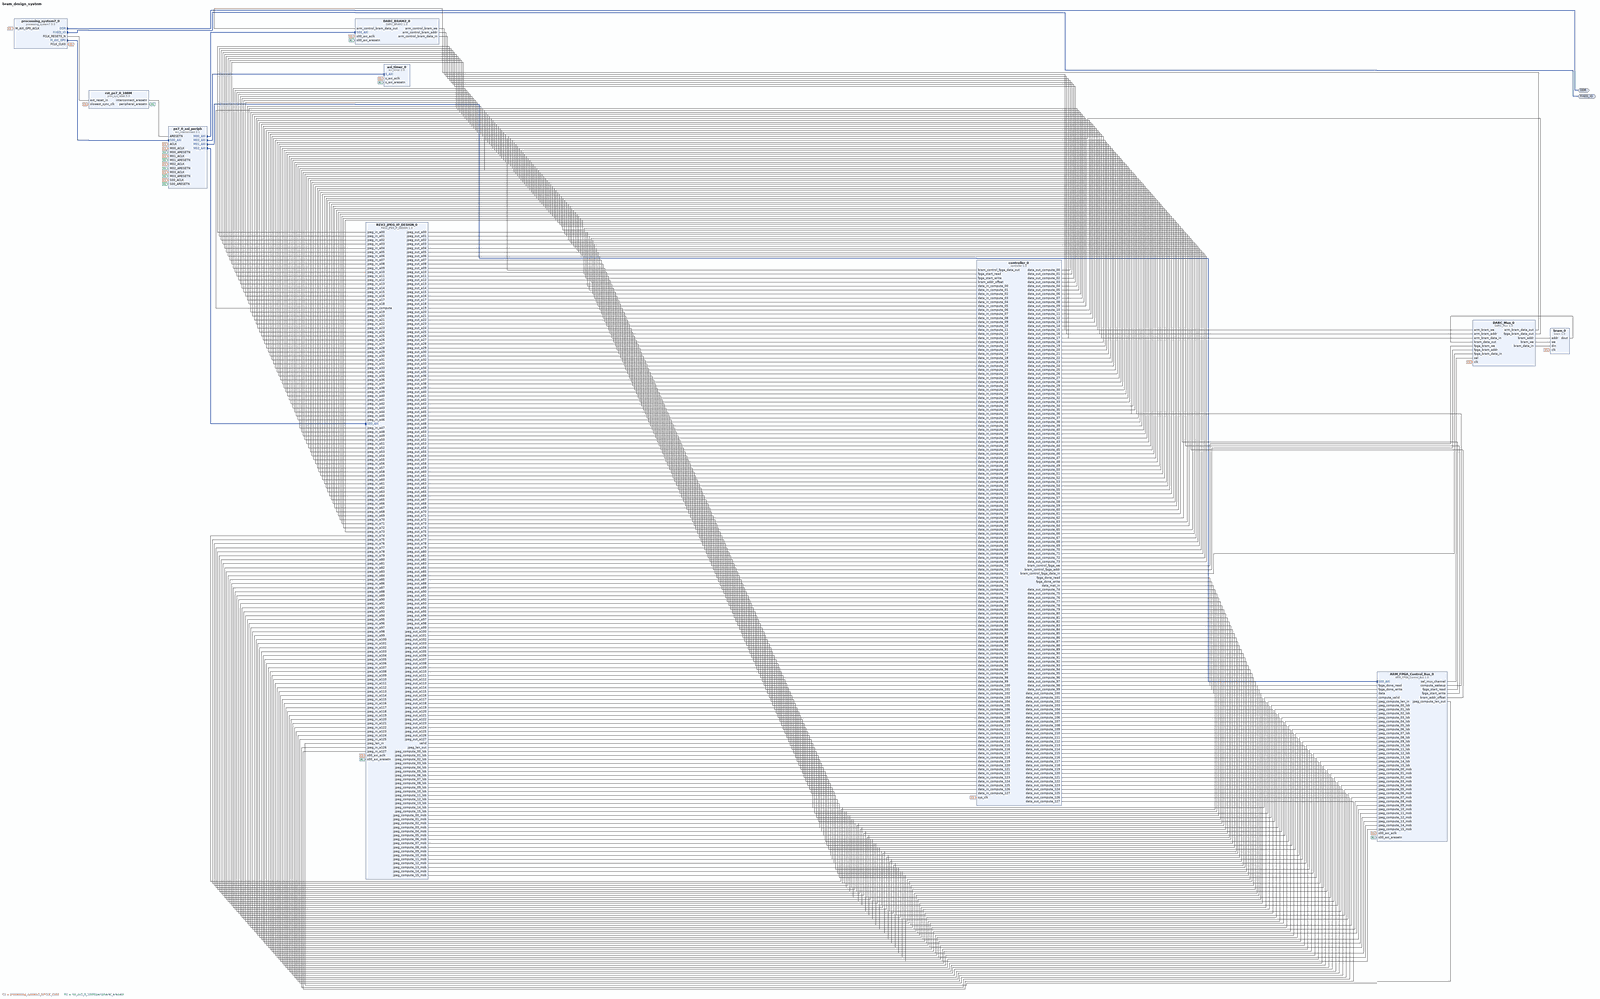
[diagram p0: block diagram of the top level, whole]
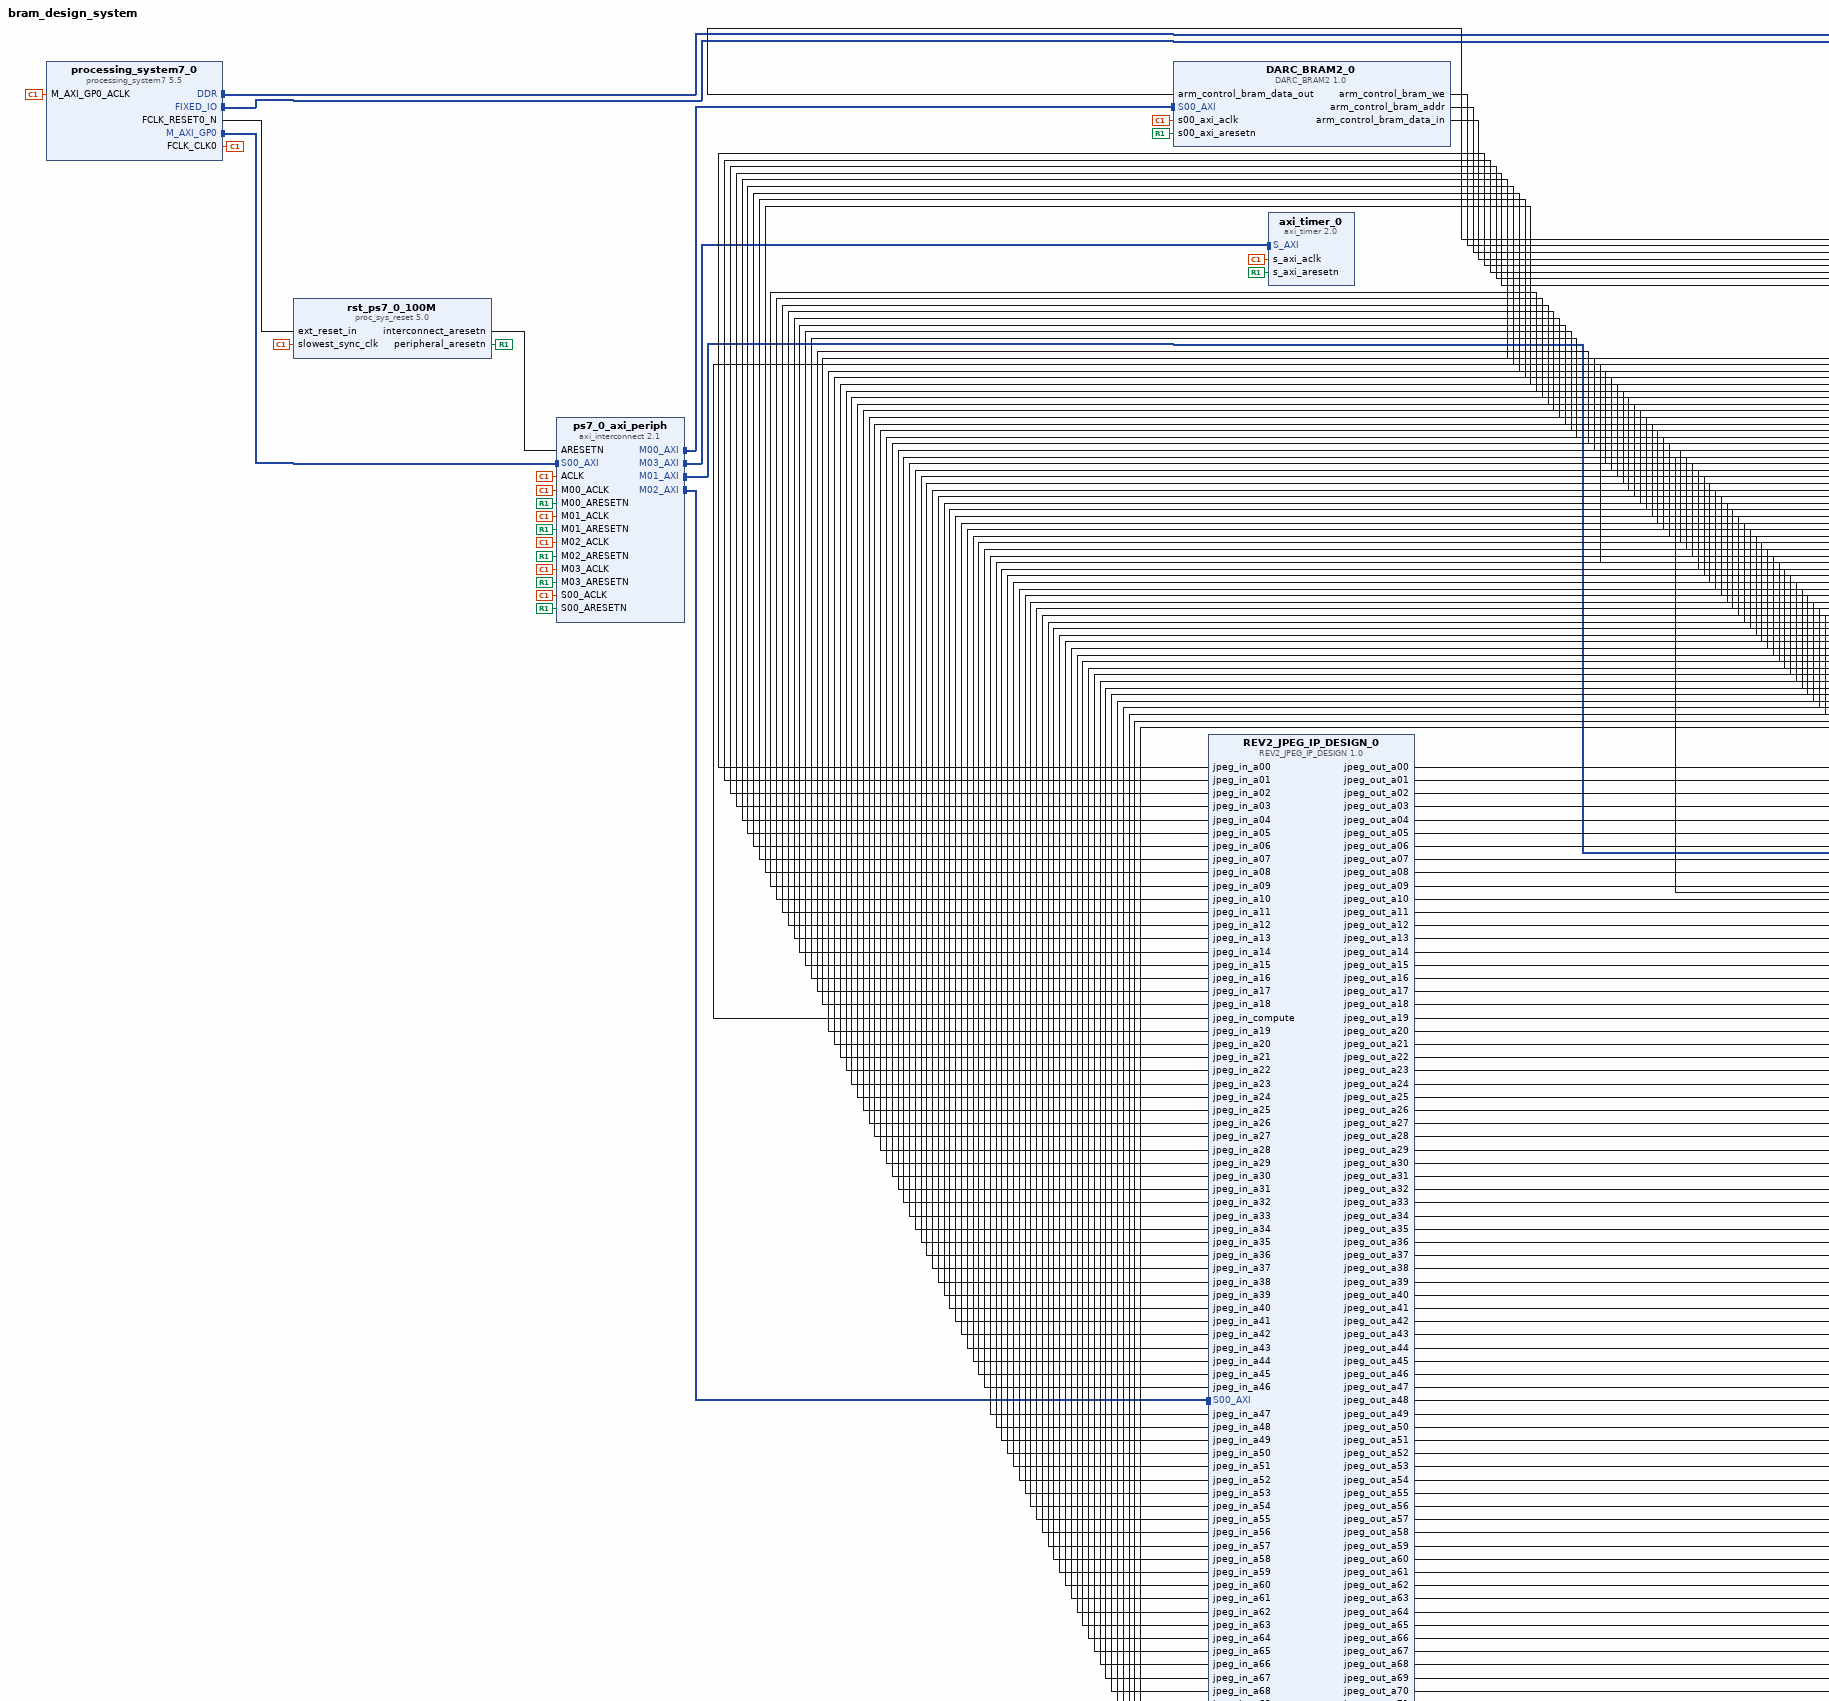
[diagram p1: block diagram of the top level, upper left part]
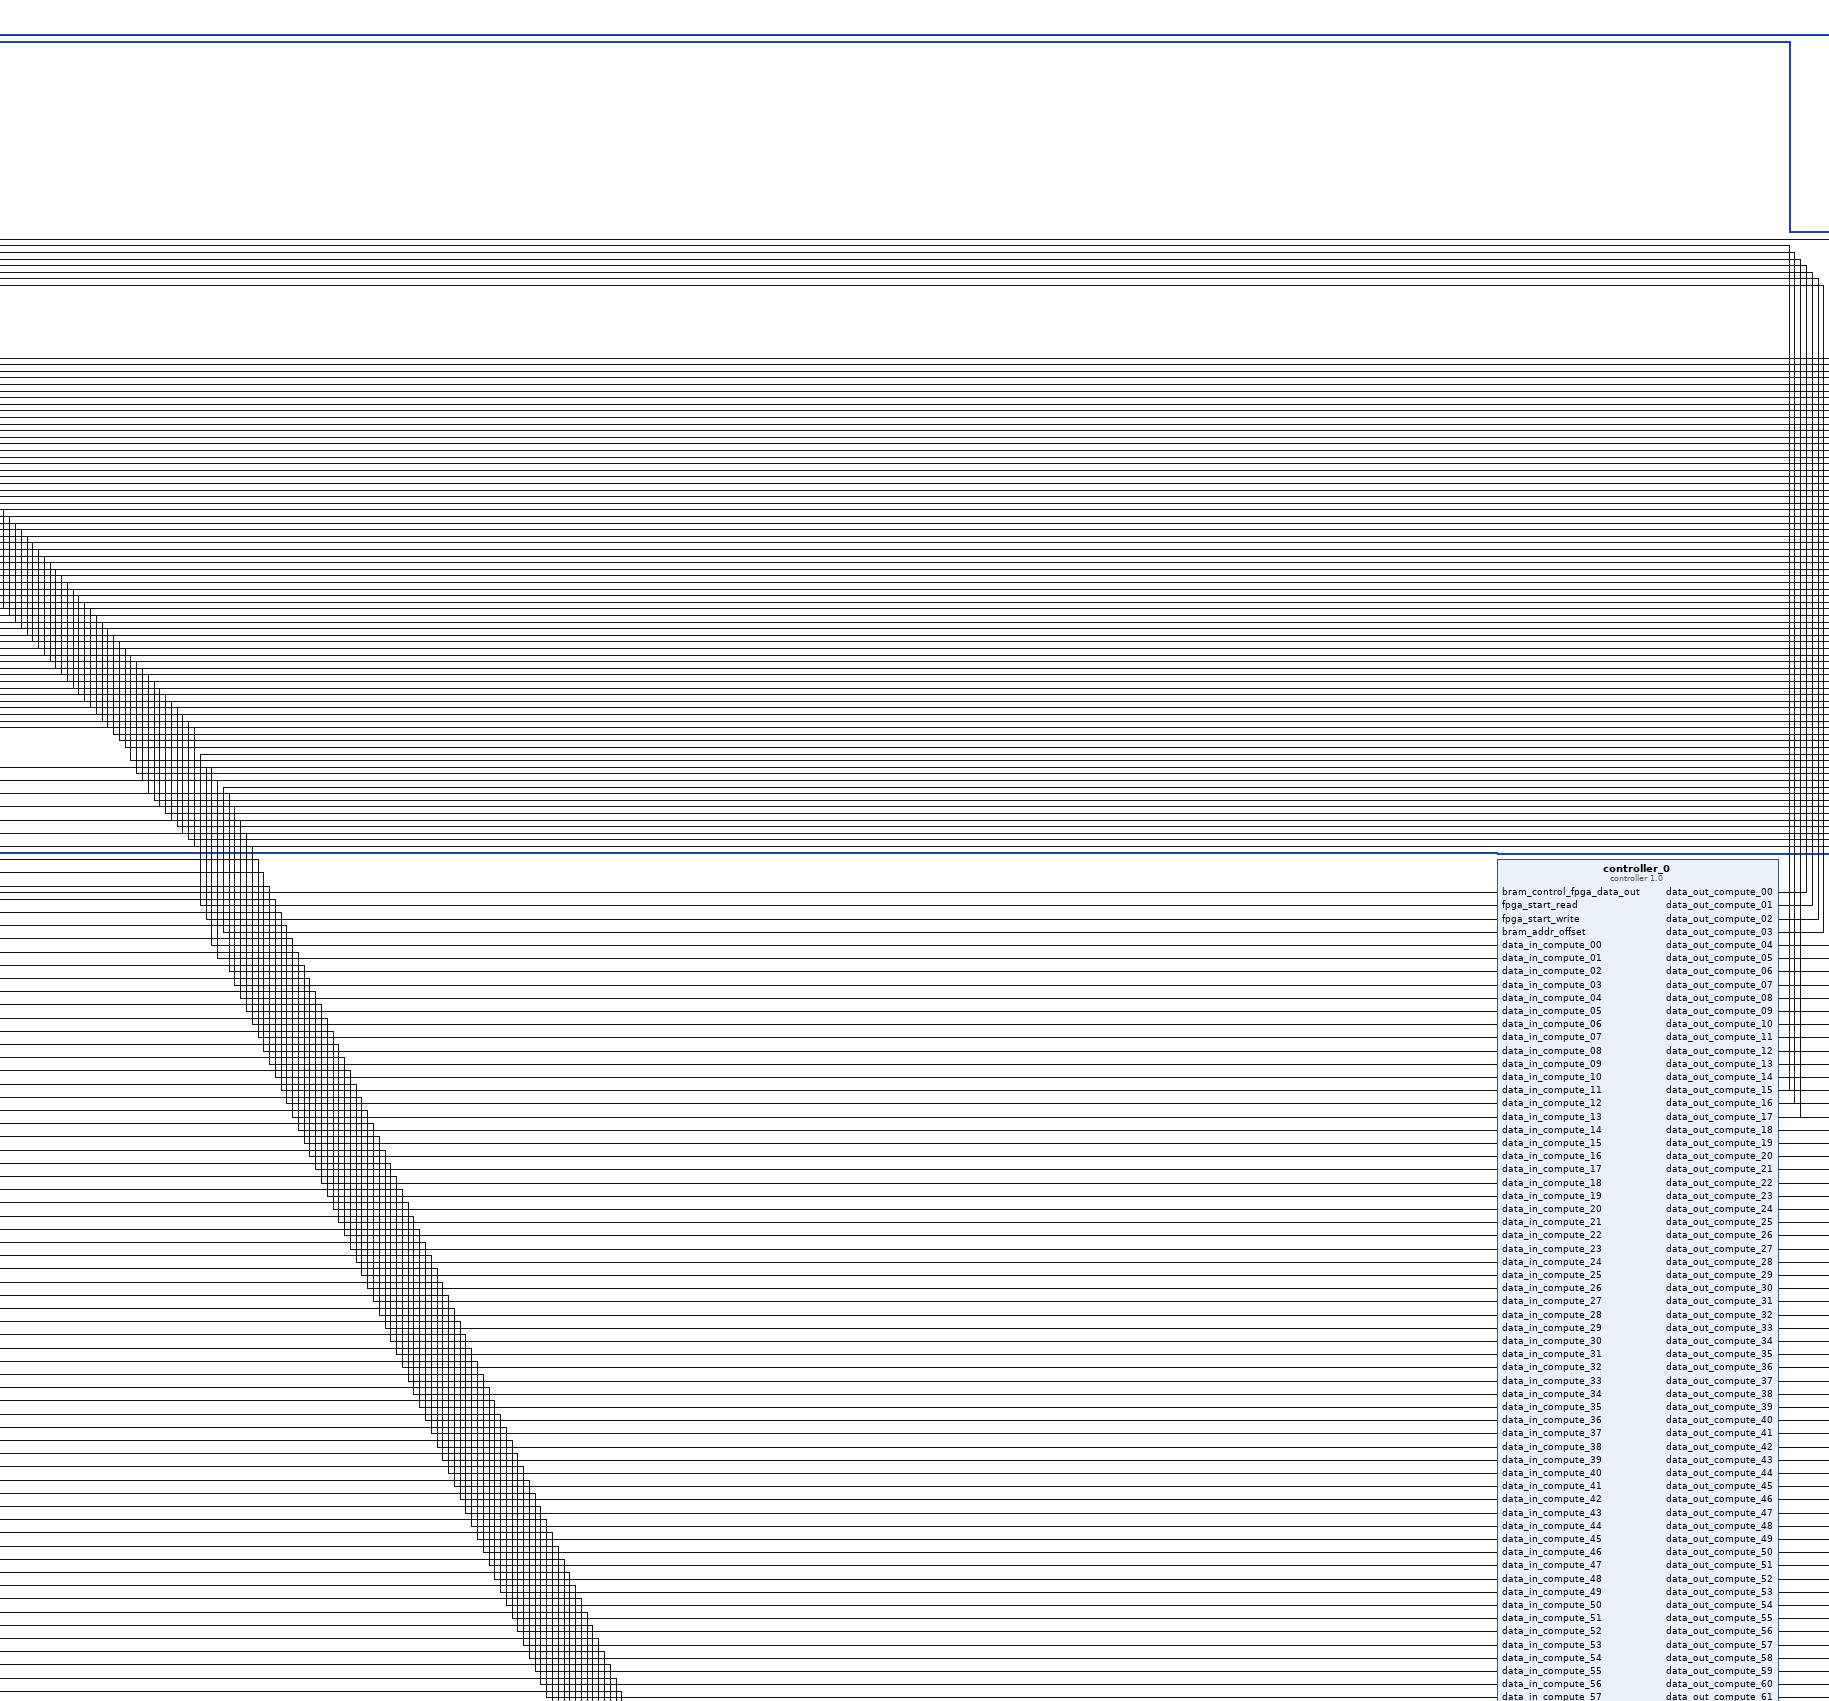
[diagram p2: block diagram of the top level, upper centre part]
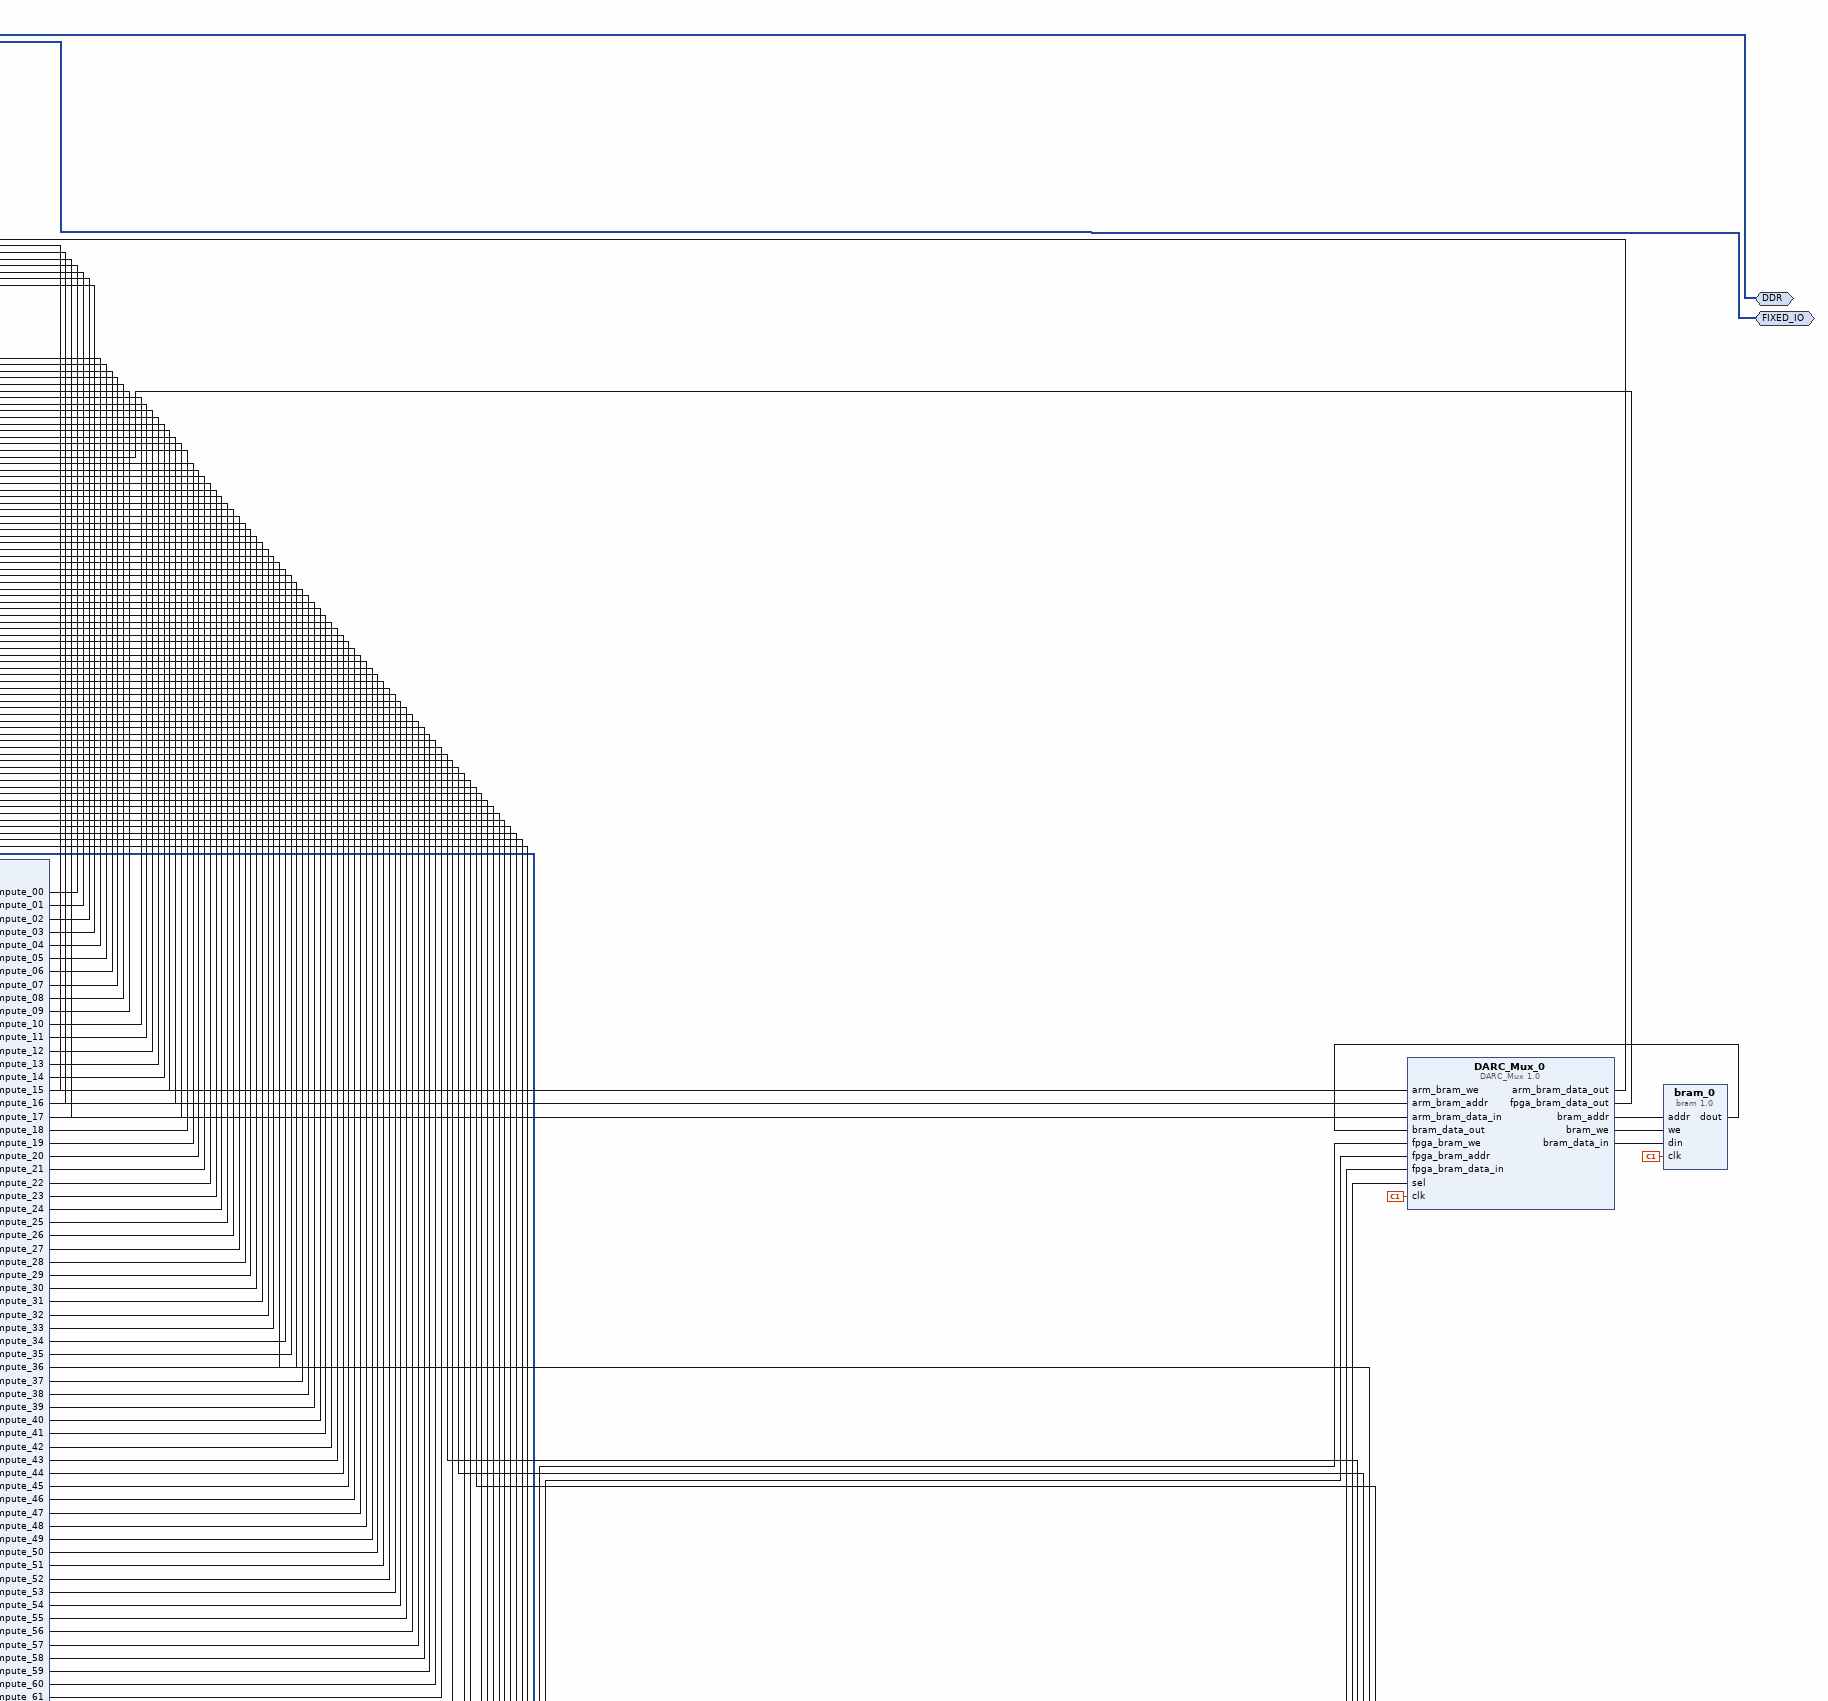
[diagram p3: block diagram of the top level, upper right part]
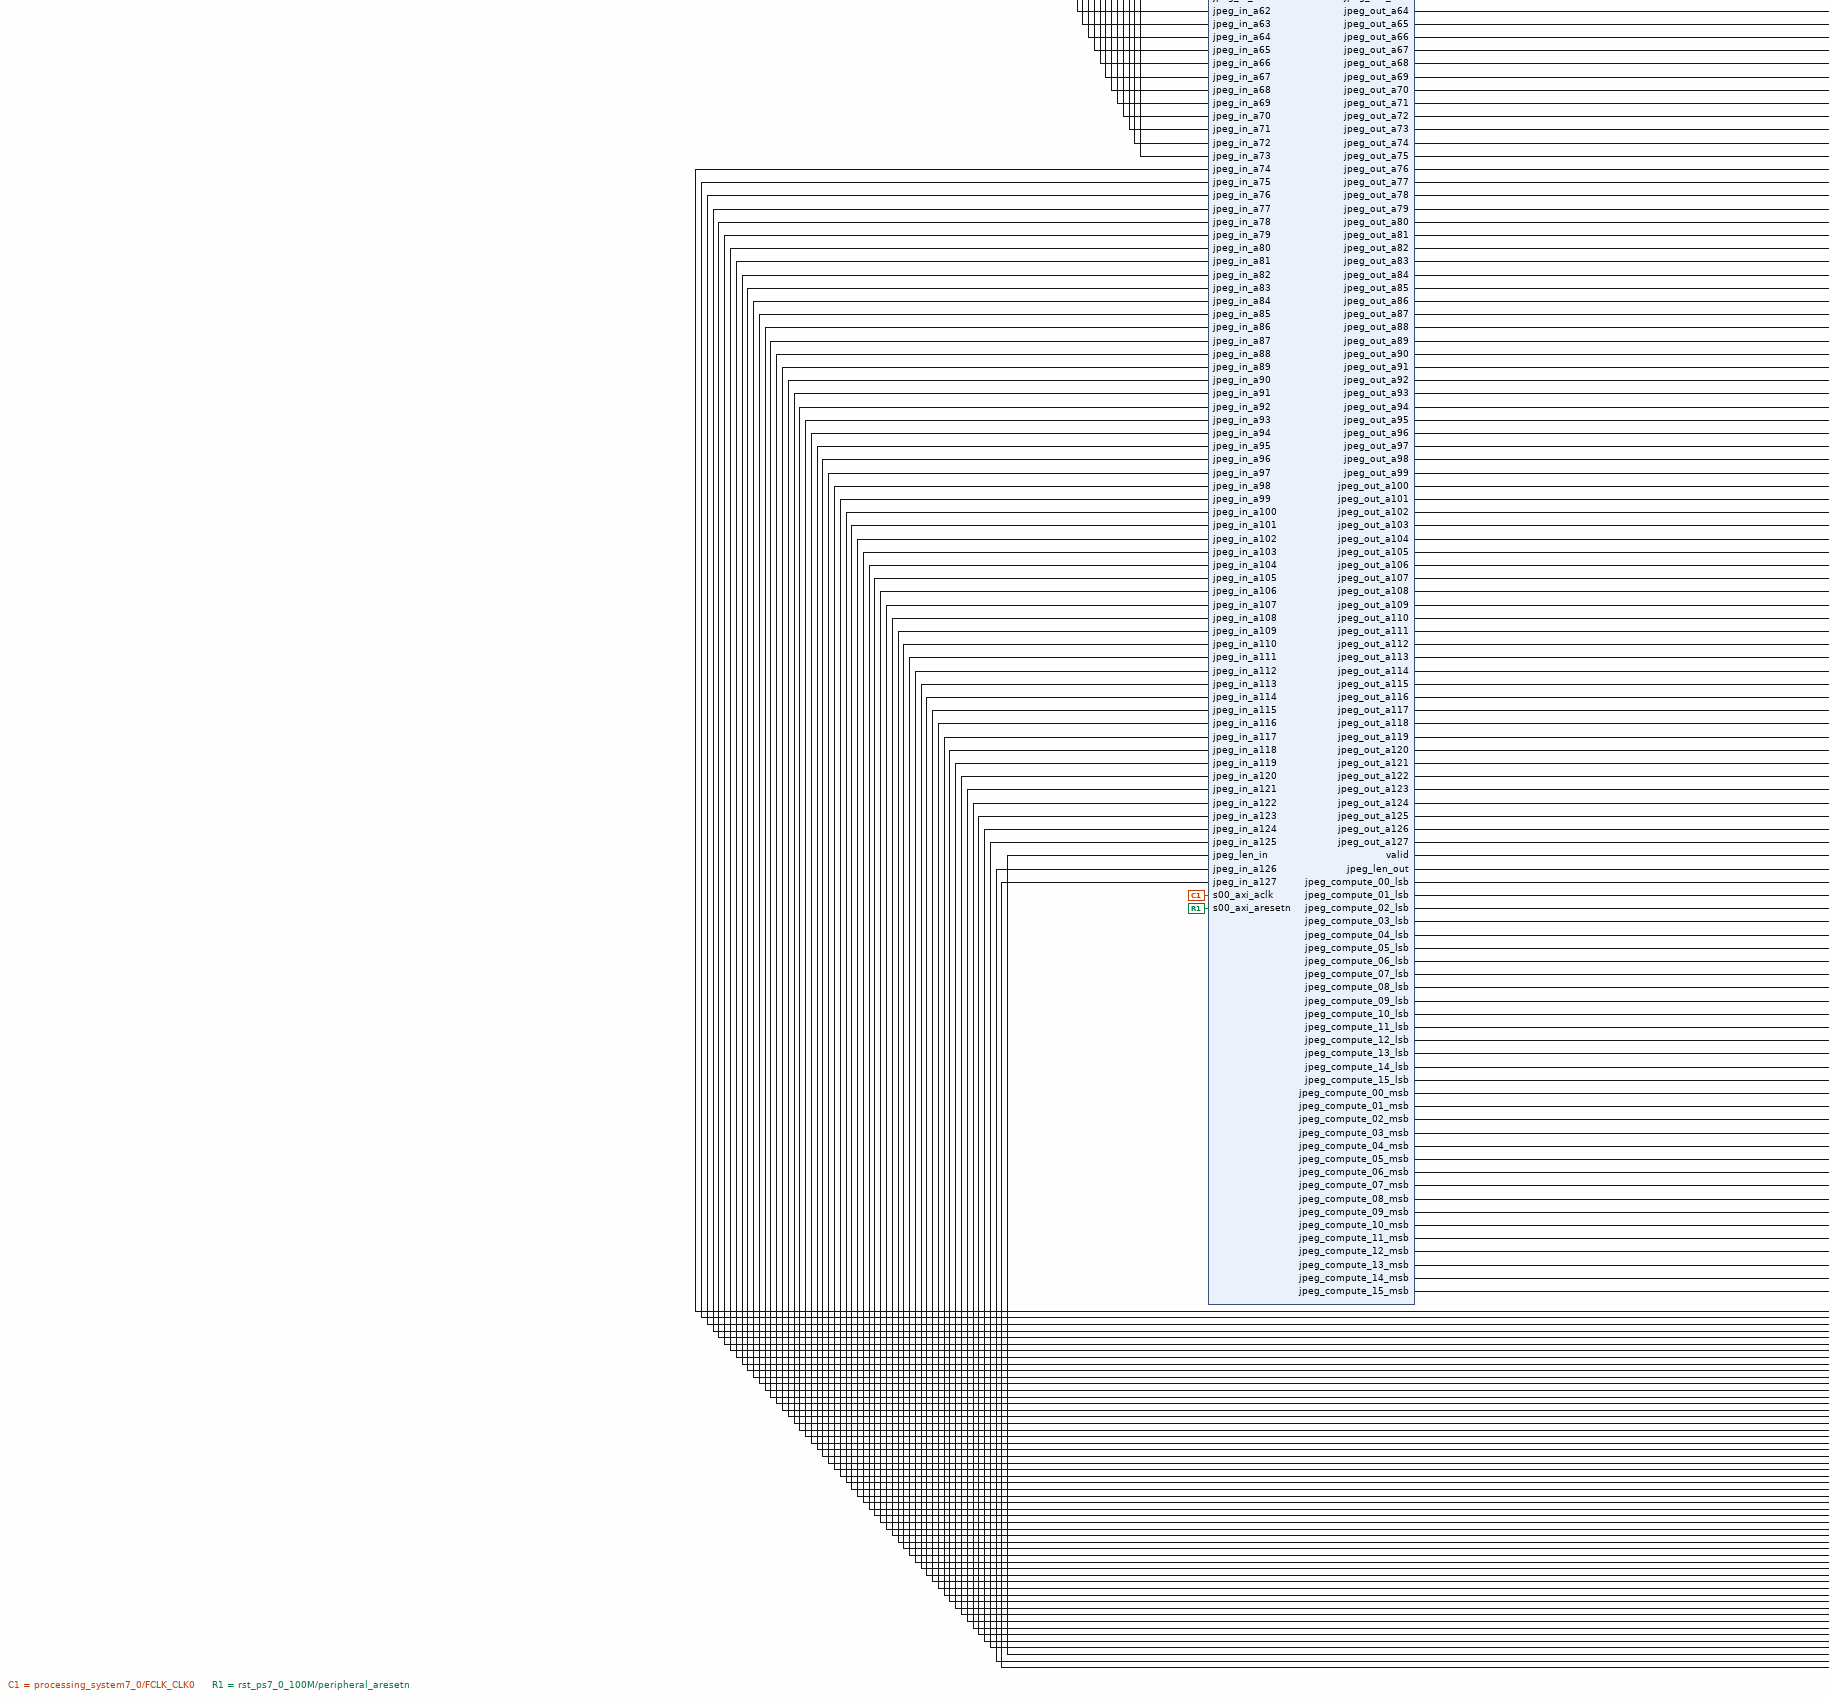
[diagram p4: block diagram of the top level, lower left part]
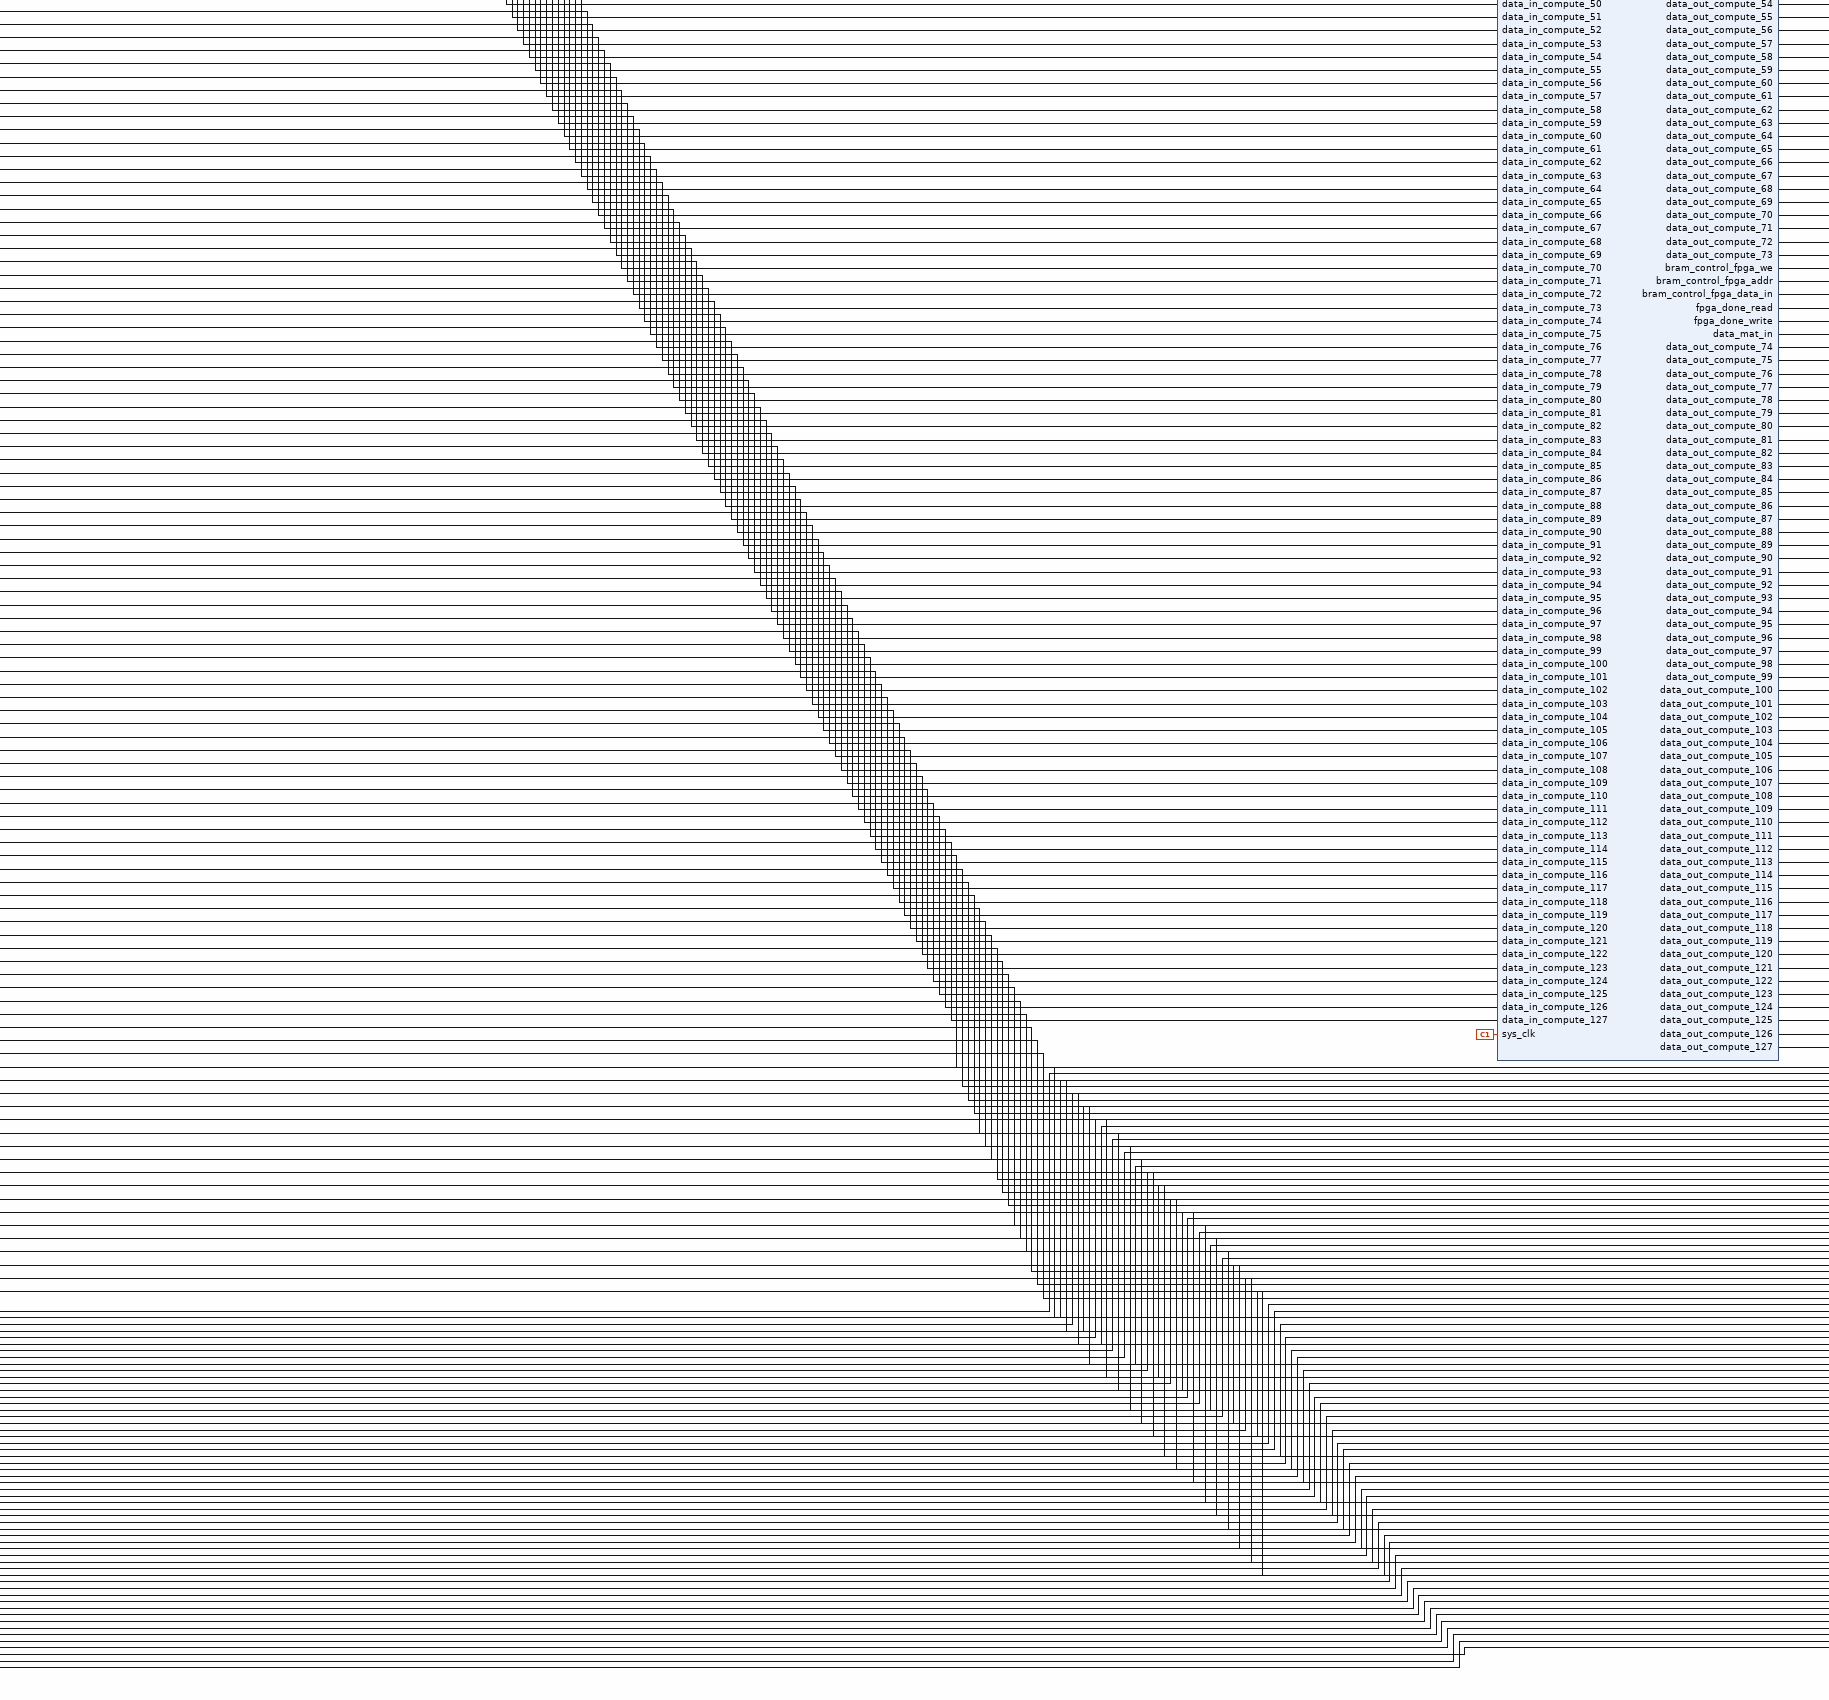
[diagram p5: block diagram of the top level, lower centre part]
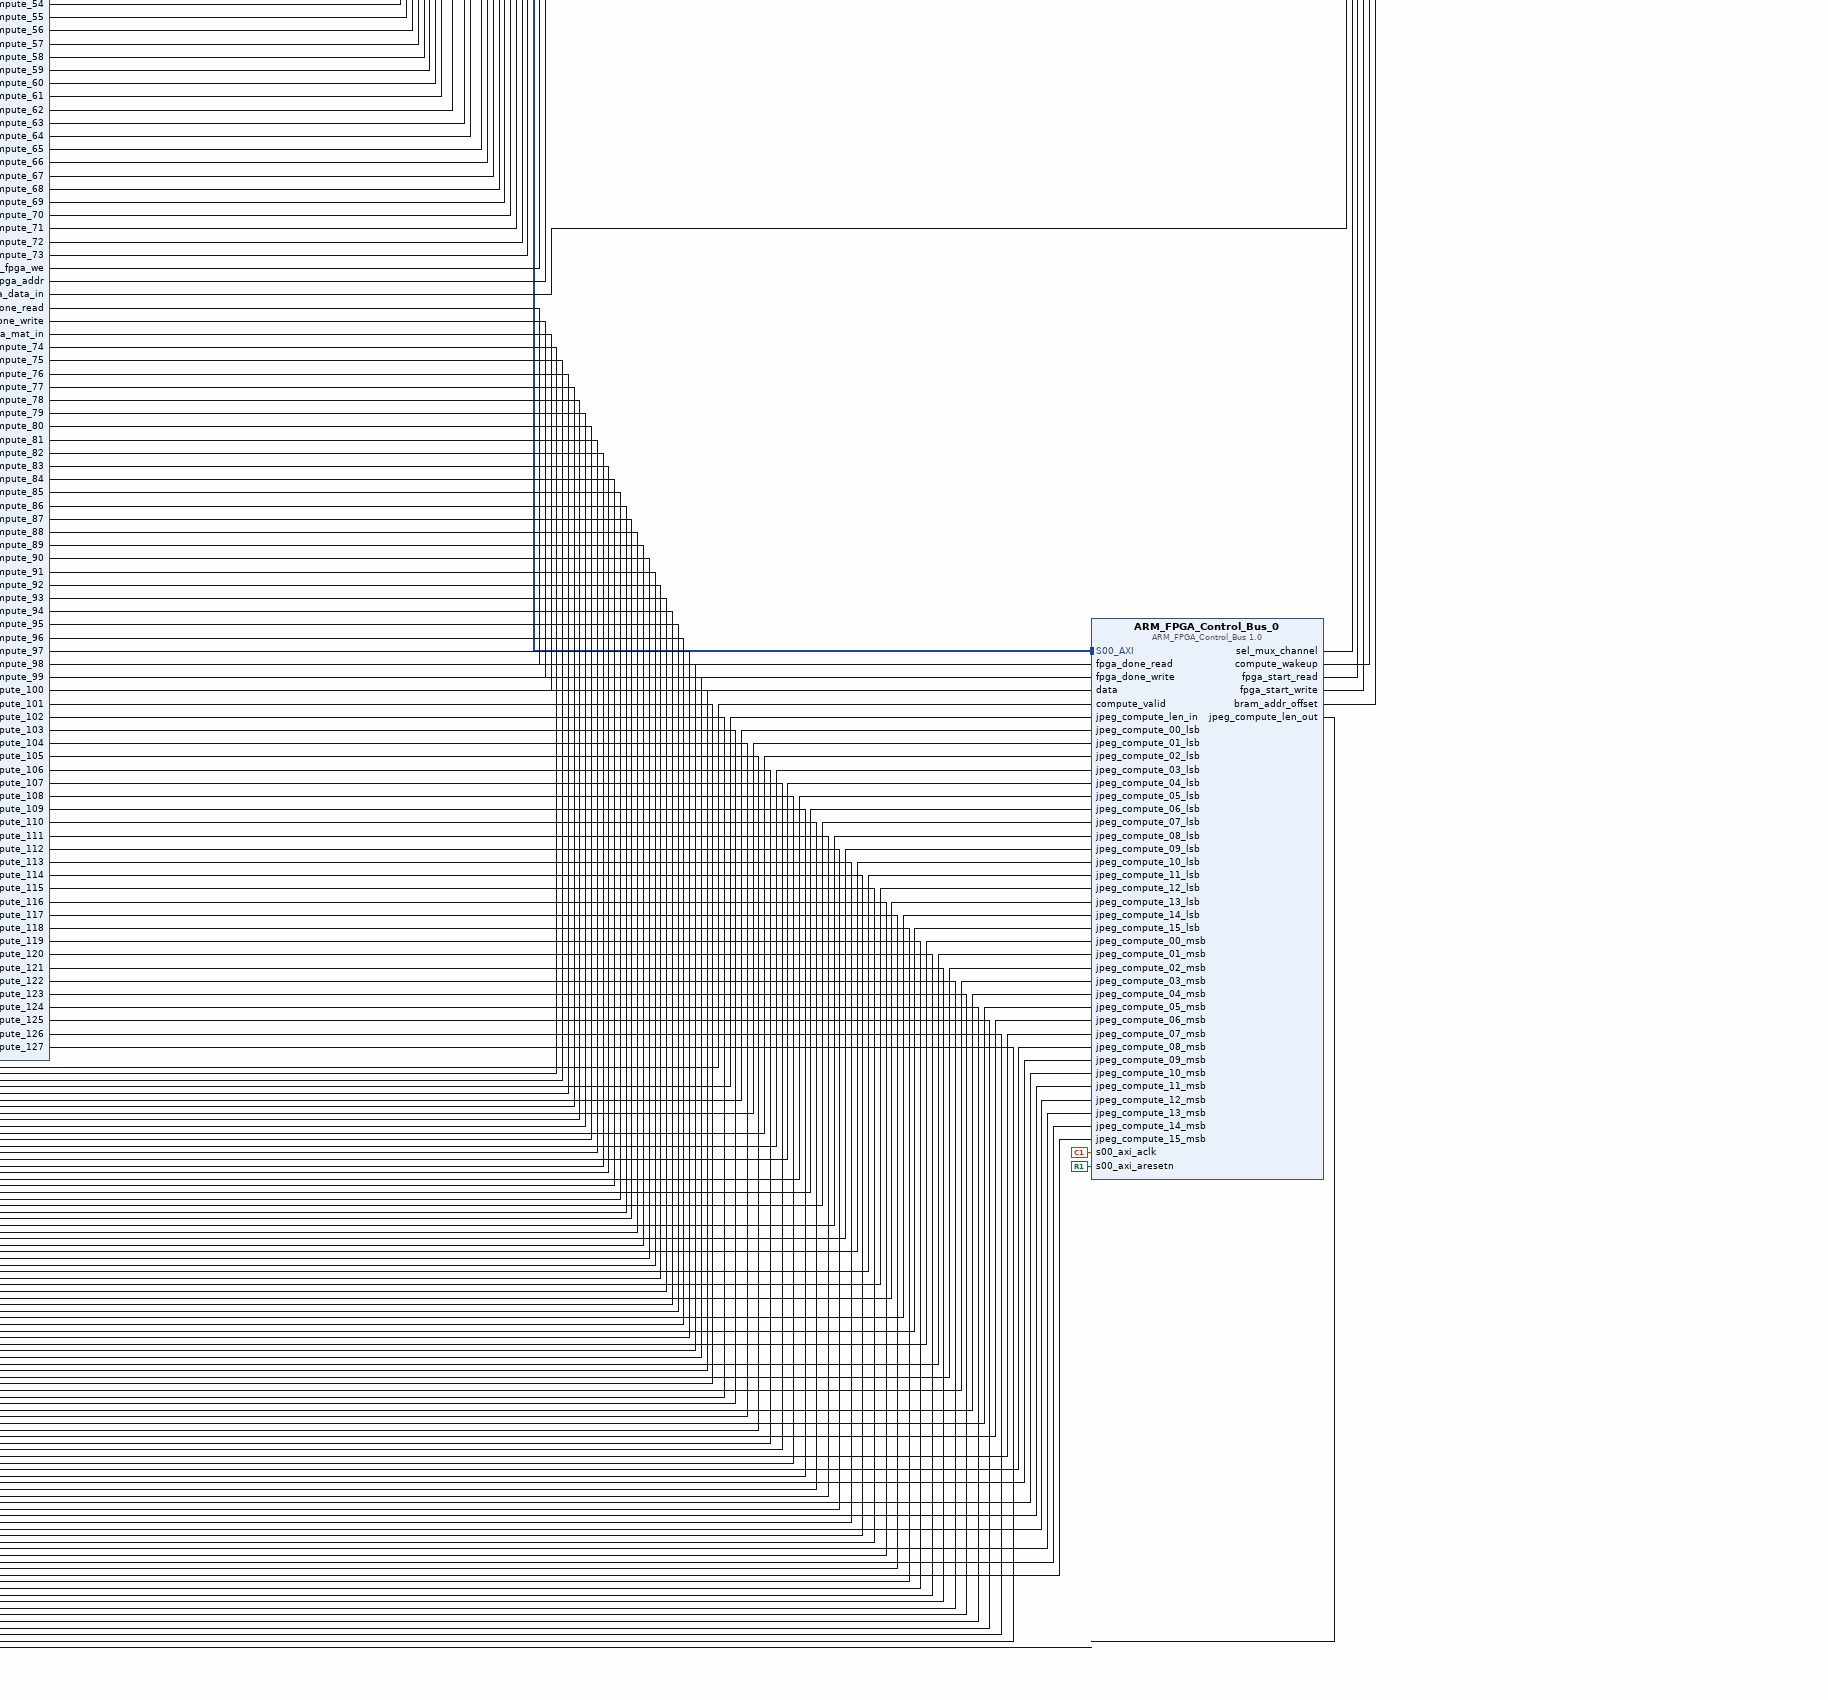
[diagram p6: block diagram of the top level, lower right part]
# Vivado block design bram_design_system, xc7z020clg484-1, Vivado 2016.3
create_bd_design bram_design_system

create_bd_intf_port -mode Master -vlnv xilinx.com:interface:ddrx_rtl:1.0 DDR
create_bd_intf_port -mode Master -vlnv xilinx.com:display_processing_system7:fixedio_rtl:1.0 FIXED_IO

create_bd_cell -type ip -vlnv xilinx.com:ip:processing_system7:5.5 processing_system7_0
set_property -dict {CONFIG.PCW_FPGA0_PERIPHERAL_FREQMHZ 50 CONFIG.preset ZedBoard} [get_bd_cells processing_system7_0]
create_bd_cell -type ip -vlnv xilinx.com:ip:axi_interconnect:2.1 ps7_0_axi_periph
set_property -dict {CONFIG.NUM_MI 4} [get_bd_cells ps7_0_axi_periph]
create_bd_cell -type ip -vlnv xilinx.com:ip:proc_sys_reset:5.0 rst_ps7_0_100M
create_bd_cell -type ip -vlnv xilinx.com:user:DARC_BRAM2:1.0 DARC_BRAM2_0
create_bd_cell -type ip -vlnv xilinx.com:user:DARC_Mux:1.0 DARC_Mux_0
create_bd_cell -type ip -vlnv xilinx.com:user:bram:1.0 bram_0
create_bd_cell -type ip -vlnv xilinx.com:user:ARM_FPGA_Control_Bus:1.0 ARM_FPGA_Control_Bus_0
create_bd_cell -type ip -vlnv xilinx.com:user:REV2_JPEG_IP_DESIGN:1.0 REV2_JPEG_IP_DESIGN_0
create_bd_cell -type ip -vlnv xilinx.com:user:controller:1.0 controller_0
create_bd_cell -type ip -vlnv xilinx.com:ip:axi_timer:2.0 axi_timer_0

# ---- connections ----

connect_bd_intf_net [get_bd_intf_pins processing_system7_0/M_AXI_GP0] [get_bd_intf_pins ps7_0_axi_periph/S00_AXI]
connect_bd_intf_net [get_bd_intf_pins ps7_0_axi_periph/M00_AXI] [get_bd_intf_pins DARC_BRAM2_0/S00_AXI]
connect_bd_intf_net [get_bd_intf_pins ps7_0_axi_periph/M01_AXI] [get_bd_intf_pins ARM_FPGA_Control_Bus_0/S00_AXI]
connect_bd_intf_net [get_bd_intf_pins ps7_0_axi_periph/M02_AXI] [get_bd_intf_pins REV2_JPEG_IP_DESIGN_0/S00_AXI]
connect_bd_intf_net [get_bd_intf_pins ps7_0_axi_periph/M03_AXI] [get_bd_intf_pins axi_timer_0/S_AXI]
connect_bd_intf_net [get_bd_intf_ports DDR] [get_bd_intf_pins processing_system7_0/DDR]
connect_bd_intf_net [get_bd_intf_ports FIXED_IO] [get_bd_intf_pins processing_system7_0/FIXED_IO]
connect_bd_net [get_bd_pins processing_system7_0/FCLK_CLK0] \
  [get_bd_pins processing_system7_0/M_AXI_GP0_ACLK] [get_bd_pins rst_ps7_0_100M/slowest_sync_clk] \
  [get_bd_pins DARC_BRAM2_0/s00_axi_aclk] [get_bd_pins DARC_Mux_0/clk] [get_bd_pins bram_0/clk] \
  [get_bd_pins ps7_0_axi_periph/S00_ACLK] [get_bd_pins ps7_0_axi_periph/ACLK] [get_bd_pins ps7_0_axi_periph/M00_ACLK] \
  [get_bd_pins ps7_0_axi_periph/M01_ACLK] [get_bd_pins ps7_0_axi_periph/M02_ACLK] \
  [get_bd_pins ARM_FPGA_Control_Bus_0/s00_axi_aclk] [get_bd_pins REV2_JPEG_IP_DESIGN_0/s00_axi_aclk] \
  [get_bd_pins controller_0/sys_clk] [get_bd_pins axi_timer_0/s_axi_aclk] [get_bd_pins ps7_0_axi_periph/M03_ACLK]
connect_bd_net [get_bd_pins processing_system7_0/FCLK_RESET0_N] [get_bd_pins rst_ps7_0_100M/ext_reset_in]
connect_bd_net [get_bd_pins rst_ps7_0_100M/peripheral_aresetn] \
  [get_bd_pins DARC_BRAM2_0/s00_axi_aresetn] [get_bd_pins ps7_0_axi_periph/S00_ARESETN] \
  [get_bd_pins ps7_0_axi_periph/M00_ARESETN] [get_bd_pins ps7_0_axi_periph/M01_ARESETN] \
  [get_bd_pins ps7_0_axi_periph/M02_ARESETN] [get_bd_pins ARM_FPGA_Control_Bus_0/s00_axi_aresetn] \
  [get_bd_pins REV2_JPEG_IP_DESIGN_0/s00_axi_aresetn] [get_bd_pins axi_timer_0/s_axi_aresetn] \
  [get_bd_pins ps7_0_axi_periph/M03_ARESETN]
connect_bd_net [get_bd_pins rst_ps7_0_100M/interconnect_aresetn] [get_bd_pins ps7_0_axi_periph/ARESETN]
connect_bd_net [get_bd_pins DARC_Mux_0/bram_addr] [get_bd_pins bram_0/addr]
connect_bd_net [get_bd_pins DARC_Mux_0/bram_we] [get_bd_pins bram_0/we]
connect_bd_net [get_bd_pins DARC_Mux_0/bram_data_in] [get_bd_pins bram_0/din]
connect_bd_net [get_bd_pins bram_0/dout] [get_bd_pins DARC_Mux_0/bram_data_out]
connect_bd_net [get_bd_pins DARC_Mux_0/arm_bram_data_out] [get_bd_pins DARC_BRAM2_0/arm_control_bram_data_out]
connect_bd_net [get_bd_pins DARC_BRAM2_0/arm_control_bram_we] [get_bd_pins DARC_Mux_0/arm_bram_we]
connect_bd_net [get_bd_pins DARC_BRAM2_0/arm_control_bram_addr] [get_bd_pins DARC_Mux_0/arm_bram_addr]
connect_bd_net [get_bd_pins DARC_BRAM2_0/arm_control_bram_data_in] [get_bd_pins DARC_Mux_0/arm_bram_data_in]
connect_bd_net [get_bd_pins ARM_FPGA_Control_Bus_0/sel_mux_channel] [get_bd_pins DARC_Mux_0/sel]
connect_bd_net [get_bd_pins controller_0/bram_control_fpga_we] [get_bd_pins DARC_Mux_0/fpga_bram_we]
connect_bd_net [get_bd_pins controller_0/bram_control_fpga_addr] [get_bd_pins DARC_Mux_0/fpga_bram_addr]
connect_bd_net [get_bd_pins controller_0/bram_control_fpga_data_in] [get_bd_pins DARC_Mux_0/fpga_bram_data_in]
connect_bd_net [get_bd_pins ARM_FPGA_Control_Bus_0/fpga_start_read] [get_bd_pins controller_0/fpga_start_read]
connect_bd_net [get_bd_pins ARM_FPGA_Control_Bus_0/fpga_start_write] [get_bd_pins controller_0/fpga_start_write]
connect_bd_net [get_bd_pins controller_0/fpga_done_read] [get_bd_pins ARM_FPGA_Control_Bus_0/fpga_done_read]
connect_bd_net [get_bd_pins controller_0/fpga_done_write] [get_bd_pins ARM_FPGA_Control_Bus_0/fpga_done_write]
connect_bd_net [get_bd_pins DARC_Mux_0/fpga_bram_data_out] [get_bd_pins controller_0/bram_control_fpga_data_out]
connect_bd_net [get_bd_pins controller_0/data_mat_in] [get_bd_pins ARM_FPGA_Control_Bus_0/data]
connect_bd_net [get_bd_pins REV2_JPEG_IP_DESIGN_0/valid] [get_bd_pins ARM_FPGA_Control_Bus_0/compute_valid]
connect_bd_net [get_bd_pins ARM_FPGA_Control_Bus_0/compute_wakeup] [get_bd_pins REV2_JPEG_IP_DESIGN_0/jpeg_in_compute]
connect_bd_net [get_bd_pins controller_0/data_out_compute_00] [get_bd_pins REV2_JPEG_IP_DESIGN_0/jpeg_in_a00]
connect_bd_net [get_bd_pins controller_0/data_out_compute_01] [get_bd_pins REV2_JPEG_IP_DESIGN_0/jpeg_in_a01]
connect_bd_net [get_bd_pins controller_0/data_out_compute_02] [get_bd_pins REV2_JPEG_IP_DESIGN_0/jpeg_in_a02]
connect_bd_net [get_bd_pins controller_0/data_out_compute_03] [get_bd_pins REV2_JPEG_IP_DESIGN_0/jpeg_in_a03]
connect_bd_net [get_bd_pins controller_0/data_out_compute_04] [get_bd_pins REV2_JPEG_IP_DESIGN_0/jpeg_in_a04]
connect_bd_net [get_bd_pins controller_0/data_out_compute_05] [get_bd_pins REV2_JPEG_IP_DESIGN_0/jpeg_in_a05]
connect_bd_net [get_bd_pins controller_0/data_out_compute_06] [get_bd_pins REV2_JPEG_IP_DESIGN_0/jpeg_in_a06]
connect_bd_net [get_bd_pins controller_0/data_out_compute_07] [get_bd_pins REV2_JPEG_IP_DESIGN_0/jpeg_in_a07]
connect_bd_net [get_bd_pins controller_0/data_out_compute_08] [get_bd_pins REV2_JPEG_IP_DESIGN_0/jpeg_in_a08]
connect_bd_net [get_bd_pins controller_0/data_out_compute_09] [get_bd_pins REV2_JPEG_IP_DESIGN_0/jpeg_in_a09]
connect_bd_net [get_bd_pins controller_0/data_out_compute_10] [get_bd_pins REV2_JPEG_IP_DESIGN_0/jpeg_in_a10]
connect_bd_net [get_bd_pins controller_0/data_out_compute_11] [get_bd_pins REV2_JPEG_IP_DESIGN_0/jpeg_in_a11]
connect_bd_net [get_bd_pins controller_0/data_out_compute_12] [get_bd_pins REV2_JPEG_IP_DESIGN_0/jpeg_in_a12]
connect_bd_net [get_bd_pins controller_0/data_out_compute_13] [get_bd_pins REV2_JPEG_IP_DESIGN_0/jpeg_in_a13]
connect_bd_net [get_bd_pins controller_0/data_out_compute_14] [get_bd_pins REV2_JPEG_IP_DESIGN_0/jpeg_in_a14]
connect_bd_net [get_bd_pins controller_0/data_out_compute_15] [get_bd_pins REV2_JPEG_IP_DESIGN_0/jpeg_in_a15]
connect_bd_net [get_bd_pins controller_0/data_out_compute_16] [get_bd_pins REV2_JPEG_IP_DESIGN_0/jpeg_in_a16]
connect_bd_net [get_bd_pins controller_0/data_out_compute_17] [get_bd_pins REV2_JPEG_IP_DESIGN_0/jpeg_in_a17]
connect_bd_net [get_bd_pins controller_0/data_out_compute_18] [get_bd_pins REV2_JPEG_IP_DESIGN_0/jpeg_in_a18]
connect_bd_net [get_bd_pins controller_0/data_out_compute_19] [get_bd_pins REV2_JPEG_IP_DESIGN_0/jpeg_in_a19]
connect_bd_net [get_bd_pins controller_0/data_out_compute_20] [get_bd_pins REV2_JPEG_IP_DESIGN_0/jpeg_in_a20]
connect_bd_net [get_bd_pins controller_0/data_out_compute_21] [get_bd_pins REV2_JPEG_IP_DESIGN_0/jpeg_in_a21]
connect_bd_net [get_bd_pins controller_0/data_out_compute_22] [get_bd_pins REV2_JPEG_IP_DESIGN_0/jpeg_in_a22]
connect_bd_net [get_bd_pins controller_0/data_out_compute_23] [get_bd_pins REV2_JPEG_IP_DESIGN_0/jpeg_in_a23]
connect_bd_net [get_bd_pins controller_0/data_out_compute_24] [get_bd_pins REV2_JPEG_IP_DESIGN_0/jpeg_in_a24]
connect_bd_net [get_bd_pins controller_0/data_out_compute_25] [get_bd_pins REV2_JPEG_IP_DESIGN_0/jpeg_in_a25]
connect_bd_net [get_bd_pins controller_0/data_out_compute_26] [get_bd_pins REV2_JPEG_IP_DESIGN_0/jpeg_in_a26]
connect_bd_net [get_bd_pins controller_0/data_out_compute_27] [get_bd_pins REV2_JPEG_IP_DESIGN_0/jpeg_in_a27]
connect_bd_net [get_bd_pins controller_0/data_out_compute_28] [get_bd_pins REV2_JPEG_IP_DESIGN_0/jpeg_in_a28]
connect_bd_net [get_bd_pins controller_0/data_out_compute_29] [get_bd_pins REV2_JPEG_IP_DESIGN_0/jpeg_in_a29]
connect_bd_net [get_bd_pins controller_0/data_out_compute_30] [get_bd_pins REV2_JPEG_IP_DESIGN_0/jpeg_in_a30]
connect_bd_net [get_bd_pins controller_0/data_out_compute_31] [get_bd_pins REV2_JPEG_IP_DESIGN_0/jpeg_in_a31]
connect_bd_net [get_bd_pins controller_0/data_out_compute_32] [get_bd_pins REV2_JPEG_IP_DESIGN_0/jpeg_in_a32]
connect_bd_net [get_bd_pins controller_0/data_out_compute_33] [get_bd_pins REV2_JPEG_IP_DESIGN_0/jpeg_in_a33]
connect_bd_net [get_bd_pins controller_0/data_out_compute_34] [get_bd_pins REV2_JPEG_IP_DESIGN_0/jpeg_in_a34]
connect_bd_net [get_bd_pins controller_0/data_out_compute_35] [get_bd_pins REV2_JPEG_IP_DESIGN_0/jpeg_in_a35]
connect_bd_net [get_bd_pins controller_0/data_out_compute_36] [get_bd_pins REV2_JPEG_IP_DESIGN_0/jpeg_in_a36]
connect_bd_net [get_bd_pins controller_0/data_out_compute_37] [get_bd_pins REV2_JPEG_IP_DESIGN_0/jpeg_in_a37]
connect_bd_net [get_bd_pins controller_0/data_out_compute_38] [get_bd_pins REV2_JPEG_IP_DESIGN_0/jpeg_in_a38]
connect_bd_net [get_bd_pins controller_0/data_out_compute_39] [get_bd_pins REV2_JPEG_IP_DESIGN_0/jpeg_in_a39]
connect_bd_net [get_bd_pins controller_0/data_out_compute_40] [get_bd_pins REV2_JPEG_IP_DESIGN_0/jpeg_in_a40]
connect_bd_net [get_bd_pins controller_0/data_out_compute_41] [get_bd_pins REV2_JPEG_IP_DESIGN_0/jpeg_in_a41]
connect_bd_net [get_bd_pins controller_0/data_out_compute_42] [get_bd_pins REV2_JPEG_IP_DESIGN_0/jpeg_in_a42]
connect_bd_net [get_bd_pins controller_0/data_out_compute_43] [get_bd_pins REV2_JPEG_IP_DESIGN_0/jpeg_in_a43]
connect_bd_net [get_bd_pins controller_0/data_out_compute_44] [get_bd_pins REV2_JPEG_IP_DESIGN_0/jpeg_in_a44]
connect_bd_net [get_bd_pins controller_0/data_out_compute_45] [get_bd_pins REV2_JPEG_IP_DESIGN_0/jpeg_in_a45]
connect_bd_net [get_bd_pins controller_0/data_out_compute_46] [get_bd_pins REV2_JPEG_IP_DESIGN_0/jpeg_in_a46]
connect_bd_net [get_bd_pins controller_0/data_out_compute_47] [get_bd_pins REV2_JPEG_IP_DESIGN_0/jpeg_in_a47]
connect_bd_net [get_bd_pins controller_0/data_out_compute_48] [get_bd_pins REV2_JPEG_IP_DESIGN_0/jpeg_in_a48]
connect_bd_net [get_bd_pins controller_0/data_out_compute_49] [get_bd_pins REV2_JPEG_IP_DESIGN_0/jpeg_in_a49]
connect_bd_net [get_bd_pins controller_0/data_out_compute_50] [get_bd_pins REV2_JPEG_IP_DESIGN_0/jpeg_in_a50]
connect_bd_net [get_bd_pins controller_0/data_out_compute_51] [get_bd_pins REV2_JPEG_IP_DESIGN_0/jpeg_in_a51]
connect_bd_net [get_bd_pins controller_0/data_out_compute_52] [get_bd_pins REV2_JPEG_IP_DESIGN_0/jpeg_in_a52]
connect_bd_net [get_bd_pins controller_0/data_out_compute_53] [get_bd_pins REV2_JPEG_IP_DESIGN_0/jpeg_in_a53]
connect_bd_net [get_bd_pins controller_0/data_out_compute_54] [get_bd_pins REV2_JPEG_IP_DESIGN_0/jpeg_in_a54]
connect_bd_net [get_bd_pins controller_0/data_out_compute_55] [get_bd_pins REV2_JPEG_IP_DESIGN_0/jpeg_in_a55]
connect_bd_net [get_bd_pins controller_0/data_out_compute_56] [get_bd_pins REV2_JPEG_IP_DESIGN_0/jpeg_in_a56]
connect_bd_net [get_bd_pins controller_0/data_out_compute_57] [get_bd_pins REV2_JPEG_IP_DESIGN_0/jpeg_in_a57]
connect_bd_net [get_bd_pins controller_0/data_out_compute_58] [get_bd_pins REV2_JPEG_IP_DESIGN_0/jpeg_in_a58]
connect_bd_net [get_bd_pins controller_0/data_out_compute_59] [get_bd_pins REV2_JPEG_IP_DESIGN_0/jpeg_in_a59]
connect_bd_net [get_bd_pins controller_0/data_out_compute_60] [get_bd_pins REV2_JPEG_IP_DESIGN_0/jpeg_in_a60]
connect_bd_net [get_bd_pins controller_0/data_out_compute_61] [get_bd_pins REV2_JPEG_IP_DESIGN_0/jpeg_in_a61]
connect_bd_net [get_bd_pins controller_0/data_out_compute_62] [get_bd_pins REV2_JPEG_IP_DESIGN_0/jpeg_in_a62]
connect_bd_net [get_bd_pins controller_0/data_out_compute_63] [get_bd_pins REV2_JPEG_IP_DESIGN_0/jpeg_in_a63]
connect_bd_net [get_bd_pins controller_0/data_out_compute_64] [get_bd_pins REV2_JPEG_IP_DESIGN_0/jpeg_in_a64]
connect_bd_net [get_bd_pins controller_0/data_out_compute_65] [get_bd_pins REV2_JPEG_IP_DESIGN_0/jpeg_in_a65]
connect_bd_net [get_bd_pins controller_0/data_out_compute_66] [get_bd_pins REV2_JPEG_IP_DESIGN_0/jpeg_in_a66]
connect_bd_net [get_bd_pins controller_0/data_out_compute_67] [get_bd_pins REV2_JPEG_IP_DESIGN_0/jpeg_in_a67]
connect_bd_net [get_bd_pins controller_0/data_out_compute_68] [get_bd_pins REV2_JPEG_IP_DESIGN_0/jpeg_in_a68]
connect_bd_net [get_bd_pins controller_0/data_out_compute_69] [get_bd_pins REV2_JPEG_IP_DESIGN_0/jpeg_in_a69]
connect_bd_net [get_bd_pins controller_0/data_out_compute_70] [get_bd_pins REV2_JPEG_IP_DESIGN_0/jpeg_in_a70]
connect_bd_net [get_bd_pins controller_0/data_out_compute_71] [get_bd_pins REV2_JPEG_IP_DESIGN_0/jpeg_in_a71]
connect_bd_net [get_bd_pins controller_0/data_out_compute_72] [get_bd_pins REV2_JPEG_IP_DESIGN_0/jpeg_in_a72]
connect_bd_net [get_bd_pins controller_0/data_out_compute_73] [get_bd_pins REV2_JPEG_IP_DESIGN_0/jpeg_in_a73]
connect_bd_net [get_bd_pins controller_0/data_out_compute_74] [get_bd_pins REV2_JPEG_IP_DESIGN_0/jpeg_in_a74]
connect_bd_net [get_bd_pins controller_0/data_out_compute_75] [get_bd_pins REV2_JPEG_IP_DESIGN_0/jpeg_in_a75]
connect_bd_net [get_bd_pins controller_0/data_out_compute_76] [get_bd_pins REV2_JPEG_IP_DESIGN_0/jpeg_in_a76]
connect_bd_net [get_bd_pins controller_0/data_out_compute_77] [get_bd_pins REV2_JPEG_IP_DESIGN_0/jpeg_in_a77]
connect_bd_net [get_bd_pins controller_0/data_out_compute_78] [get_bd_pins REV2_JPEG_IP_DESIGN_0/jpeg_in_a78]
connect_bd_net [get_bd_pins controller_0/data_out_compute_79] [get_bd_pins REV2_JPEG_IP_DESIGN_0/jpeg_in_a79]
connect_bd_net [get_bd_pins controller_0/data_out_compute_80] [get_bd_pins REV2_JPEG_IP_DESIGN_0/jpeg_in_a80]
connect_bd_net [get_bd_pins controller_0/data_out_compute_81] [get_bd_pins REV2_JPEG_IP_DESIGN_0/jpeg_in_a81]
connect_bd_net [get_bd_pins controller_0/data_out_compute_82] [get_bd_pins REV2_JPEG_IP_DESIGN_0/jpeg_in_a82]
connect_bd_net [get_bd_pins controller_0/data_out_compute_83] [get_bd_pins REV2_JPEG_IP_DESIGN_0/jpeg_in_a83]
connect_bd_net [get_bd_pins controller_0/data_out_compute_84] [get_bd_pins REV2_JPEG_IP_DESIGN_0/jpeg_in_a84]
connect_bd_net [get_bd_pins controller_0/data_out_compute_85] [get_bd_pins REV2_JPEG_IP_DESIGN_0/jpeg_in_a85]
connect_bd_net [get_bd_pins controller_0/data_out_compute_86] [get_bd_pins REV2_JPEG_IP_DESIGN_0/jpeg_in_a86]
connect_bd_net [get_bd_pins controller_0/data_out_compute_87] [get_bd_pins REV2_JPEG_IP_DESIGN_0/jpeg_in_a87]
connect_bd_net [get_bd_pins controller_0/data_out_compute_88] [get_bd_pins REV2_JPEG_IP_DESIGN_0/jpeg_in_a88]
connect_bd_net [get_bd_pins controller_0/data_out_compute_89] [get_bd_pins REV2_JPEG_IP_DESIGN_0/jpeg_in_a89]
connect_bd_net [get_bd_pins controller_0/data_out_compute_90] [get_bd_pins REV2_JPEG_IP_DESIGN_0/jpeg_in_a90]
connect_bd_net [get_bd_pins controller_0/data_out_compute_91] [get_bd_pins REV2_JPEG_IP_DESIGN_0/jpeg_in_a91]
connect_bd_net [get_bd_pins controller_0/data_out_compute_92] [get_bd_pins REV2_JPEG_IP_DESIGN_0/jpeg_in_a92]
connect_bd_net [get_bd_pins controller_0/data_out_compute_93] [get_bd_pins REV2_JPEG_IP_DESIGN_0/jpeg_in_a93]
connect_bd_net [get_bd_pins controller_0/data_out_compute_94] [get_bd_pins REV2_JPEG_IP_DESIGN_0/jpeg_in_a94]
connect_bd_net [get_bd_pins controller_0/data_out_compute_95] [get_bd_pins REV2_JPEG_IP_DESIGN_0/jpeg_in_a95]
connect_bd_net [get_bd_pins controller_0/data_out_compute_96] [get_bd_pins REV2_JPEG_IP_DESIGN_0/jpeg_in_a96]
connect_bd_net [get_bd_pins controller_0/data_out_compute_97] [get_bd_pins REV2_JPEG_IP_DESIGN_0/jpeg_in_a97]
connect_bd_net [get_bd_pins controller_0/data_out_compute_98] [get_bd_pins REV2_JPEG_IP_DESIGN_0/jpeg_in_a98]
connect_bd_net [get_bd_pins controller_0/data_out_compute_99] [get_bd_pins REV2_JPEG_IP_DESIGN_0/jpeg_in_a99]
connect_bd_net [get_bd_pins controller_0/data_out_compute_100] [get_bd_pins REV2_JPEG_IP_DESIGN_0/jpeg_in_a100]
connect_bd_net [get_bd_pins controller_0/data_out_compute_101] [get_bd_pins REV2_JPEG_IP_DESIGN_0/jpeg_in_a101]
connect_bd_net [get_bd_pins controller_0/data_out_compute_102] [get_bd_pins REV2_JPEG_IP_DESIGN_0/jpeg_in_a102]
connect_bd_net [get_bd_pins controller_0/data_out_compute_103] [get_bd_pins REV2_JPEG_IP_DESIGN_0/jpeg_in_a103]
connect_bd_net [get_bd_pins controller_0/data_out_compute_104] [get_bd_pins REV2_JPEG_IP_DESIGN_0/jpeg_in_a104]
connect_bd_net [get_bd_pins controller_0/data_out_compute_105] [get_bd_pins REV2_JPEG_IP_DESIGN_0/jpeg_in_a105]
connect_bd_net [get_bd_pins controller_0/data_out_compute_106] [get_bd_pins REV2_JPEG_IP_DESIGN_0/jpeg_in_a106]
connect_bd_net [get_bd_pins controller_0/data_out_compute_107] [get_bd_pins REV2_JPEG_IP_DESIGN_0/jpeg_in_a107]
connect_bd_net [get_bd_pins controller_0/data_out_compute_108] [get_bd_pins REV2_JPEG_IP_DESIGN_0/jpeg_in_a108]
connect_bd_net [get_bd_pins controller_0/data_out_compute_109] [get_bd_pins REV2_JPEG_IP_DESIGN_0/jpeg_in_a109]
connect_bd_net [get_bd_pins controller_0/data_out_compute_110] [get_bd_pins REV2_JPEG_IP_DESIGN_0/jpeg_in_a110]
connect_bd_net [get_bd_pins controller_0/data_out_compute_111] [get_bd_pins REV2_JPEG_IP_DESIGN_0/jpeg_in_a111]
connect_bd_net [get_bd_pins controller_0/data_out_compute_112] [get_bd_pins REV2_JPEG_IP_DESIGN_0/jpeg_in_a112]
connect_bd_net [get_bd_pins controller_0/data_out_compute_113] [get_bd_pins REV2_JPEG_IP_DESIGN_0/jpeg_in_a113]
connect_bd_net [get_bd_pins controller_0/data_out_compute_114] [get_bd_pins REV2_JPEG_IP_DESIGN_0/jpeg_in_a114]
connect_bd_net [get_bd_pins controller_0/data_out_compute_115] [get_bd_pins REV2_JPEG_IP_DESIGN_0/jpeg_in_a115]
connect_bd_net [get_bd_pins controller_0/data_out_compute_116] [get_bd_pins REV2_JPEG_IP_DESIGN_0/jpeg_in_a116]
connect_bd_net [get_bd_pins controller_0/data_out_compute_117] [get_bd_pins REV2_JPEG_IP_DESIGN_0/jpeg_in_a117]
connect_bd_net [get_bd_pins controller_0/data_out_compute_118] [get_bd_pins REV2_JPEG_IP_DESIGN_0/jpeg_in_a118]
connect_bd_net [get_bd_pins controller_0/data_out_compute_119] [get_bd_pins REV2_JPEG_IP_DESIGN_0/jpeg_in_a119]
connect_bd_net [get_bd_pins controller_0/data_out_compute_120] [get_bd_pins REV2_JPEG_IP_DESIGN_0/jpeg_in_a120]
connect_bd_net [get_bd_pins controller_0/data_out_compute_121] [get_bd_pins REV2_JPEG_IP_DESIGN_0/jpeg_in_a121]
connect_bd_net [get_bd_pins controller_0/data_out_compute_122] [get_bd_pins REV2_JPEG_IP_DESIGN_0/jpeg_in_a122]
connect_bd_net [get_bd_pins controller_0/data_out_compute_123] [get_bd_pins REV2_JPEG_IP_DESIGN_0/jpeg_in_a123]
connect_bd_net [get_bd_pins controller_0/data_out_compute_124] [get_bd_pins REV2_JPEG_IP_DESIGN_0/jpeg_in_a124]
connect_bd_net [get_bd_pins controller_0/data_out_compute_125] [get_bd_pins REV2_JPEG_IP_DESIGN_0/jpeg_in_a125]
connect_bd_net [get_bd_pins controller_0/data_out_compute_126] [get_bd_pins REV2_JPEG_IP_DESIGN_0/jpeg_in_a126]
connect_bd_net [get_bd_pins controller_0/data_out_compute_127] [get_bd_pins REV2_JPEG_IP_DESIGN_0/jpeg_in_a127]
connect_bd_net [get_bd_pins REV2_JPEG_IP_DESIGN_0/jpeg_out_a00] [get_bd_pins controller_0/data_in_compute_00]
connect_bd_net [get_bd_pins REV2_JPEG_IP_DESIGN_0/jpeg_out_a01] [get_bd_pins controller_0/data_in_compute_01]
connect_bd_net [get_bd_pins REV2_JPEG_IP_DESIGN_0/jpeg_out_a02] [get_bd_pins controller_0/data_in_compute_02]
connect_bd_net [get_bd_pins REV2_JPEG_IP_DESIGN_0/jpeg_out_a03] [get_bd_pins controller_0/data_in_compute_03]
connect_bd_net [get_bd_pins REV2_JPEG_IP_DESIGN_0/jpeg_out_a04] [get_bd_pins controller_0/data_in_compute_04]
connect_bd_net [get_bd_pins REV2_JPEG_IP_DESIGN_0/jpeg_out_a05] [get_bd_pins controller_0/data_in_compute_05]
connect_bd_net [get_bd_pins REV2_JPEG_IP_DESIGN_0/jpeg_out_a06] [get_bd_pins controller_0/data_in_compute_06]
connect_bd_net [get_bd_pins REV2_JPEG_IP_DESIGN_0/jpeg_out_a07] [get_bd_pins controller_0/data_in_compute_07]
connect_bd_net [get_bd_pins REV2_JPEG_IP_DESIGN_0/jpeg_out_a08] [get_bd_pins controller_0/data_in_compute_08]
connect_bd_net [get_bd_pins REV2_JPEG_IP_DESIGN_0/jpeg_out_a09] [get_bd_pins controller_0/data_in_compute_09]
connect_bd_net [get_bd_pins REV2_JPEG_IP_DESIGN_0/jpeg_out_a10] [get_bd_pins controller_0/data_in_compute_10]
connect_bd_net [get_bd_pins REV2_JPEG_IP_DESIGN_0/jpeg_out_a11] [get_bd_pins controller_0/data_in_compute_11]
connect_bd_net [get_bd_pins REV2_JPEG_IP_DESIGN_0/jpeg_out_a12] [get_bd_pins controller_0/data_in_compute_12]
connect_bd_net [get_bd_pins REV2_JPEG_IP_DESIGN_0/jpeg_out_a13] [get_bd_pins controller_0/data_in_compute_13]
connect_bd_net [get_bd_pins REV2_JPEG_IP_DESIGN_0/jpeg_out_a14] [get_bd_pins controller_0/data_in_compute_14]
connect_bd_net [get_bd_pins REV2_JPEG_IP_DESIGN_0/jpeg_out_a15] [get_bd_pins controller_0/data_in_compute_15]
connect_bd_net [get_bd_pins REV2_JPEG_IP_DESIGN_0/jpeg_out_a16] [get_bd_pins controller_0/data_in_compute_16]
connect_bd_net [get_bd_pins REV2_JPEG_IP_DESIGN_0/jpeg_out_a17] [get_bd_pins controller_0/data_in_compute_17]
connect_bd_net [get_bd_pins REV2_JPEG_IP_DESIGN_0/jpeg_out_a18] [get_bd_pins controller_0/data_in_compute_18]
connect_bd_net [get_bd_pins REV2_JPEG_IP_DESIGN_0/jpeg_out_a19] [get_bd_pins controller_0/data_in_compute_19]
connect_bd_net [get_bd_pins REV2_JPEG_IP_DESIGN_0/jpeg_out_a20] [get_bd_pins controller_0/data_in_compute_20]
connect_bd_net [get_bd_pins REV2_JPEG_IP_DESIGN_0/jpeg_out_a21] [get_bd_pins controller_0/data_in_compute_21]
connect_bd_net [get_bd_pins REV2_JPEG_IP_DESIGN_0/jpeg_out_a22] [get_bd_pins controller_0/data_in_compute_22]
connect_bd_net [get_bd_pins REV2_JPEG_IP_DESIGN_0/jpeg_out_a23] [get_bd_pins controller_0/data_in_compute_23]
connect_bd_net [get_bd_pins REV2_JPEG_IP_DESIGN_0/jpeg_out_a24] [get_bd_pins controller_0/data_in_compute_24]
connect_bd_net [get_bd_pins REV2_JPEG_IP_DESIGN_0/jpeg_out_a25] [get_bd_pins controller_0/data_in_compute_25]
connect_bd_net [get_bd_pins REV2_JPEG_IP_DESIGN_0/jpeg_out_a26] [get_bd_pins controller_0/data_in_compute_26]
connect_bd_net [get_bd_pins REV2_JPEG_IP_DESIGN_0/jpeg_out_a27] [get_bd_pins controller_0/data_in_compute_27]
connect_bd_net [get_bd_pins REV2_JPEG_IP_DESIGN_0/jpeg_out_a28] [get_bd_pins controller_0/data_in_compute_28]
connect_bd_net [get_bd_pins REV2_JPEG_IP_DESIGN_0/jpeg_out_a29] [get_bd_pins controller_0/data_in_compute_29]
connect_bd_net [get_bd_pins REV2_JPEG_IP_DESIGN_0/jpeg_out_a30] [get_bd_pins controller_0/data_in_compute_30]
connect_bd_net [get_bd_pins REV2_JPEG_IP_DESIGN_0/jpeg_out_a31] [get_bd_pins controller_0/data_in_compute_31]
connect_bd_net [get_bd_pins REV2_JPEG_IP_DESIGN_0/jpeg_out_a32] [get_bd_pins controller_0/data_in_compute_32]
connect_bd_net [get_bd_pins REV2_JPEG_IP_DESIGN_0/jpeg_out_a33] [get_bd_pins controller_0/data_in_compute_33]
connect_bd_net [get_bd_pins REV2_JPEG_IP_DESIGN_0/jpeg_out_a34] [get_bd_pins controller_0/data_in_compute_34]
connect_bd_net [get_bd_pins REV2_JPEG_IP_DESIGN_0/jpeg_out_a35] [get_bd_pins controller_0/data_in_compute_35]
connect_bd_net [get_bd_pins REV2_JPEG_IP_DESIGN_0/jpeg_out_a36] [get_bd_pins controller_0/data_in_compute_36]
connect_bd_net [get_bd_pins REV2_JPEG_IP_DESIGN_0/jpeg_out_a37] [get_bd_pins controller_0/data_in_compute_37]
connect_bd_net [get_bd_pins REV2_JPEG_IP_DESIGN_0/jpeg_out_a38] [get_bd_pins controller_0/data_in_compute_38]
connect_bd_net [get_bd_pins REV2_JPEG_IP_DESIGN_0/jpeg_out_a39] [get_bd_pins controller_0/data_in_compute_39]
connect_bd_net [get_bd_pins REV2_JPEG_IP_DESIGN_0/jpeg_out_a40] [get_bd_pins controller_0/data_in_compute_40]
connect_bd_net [get_bd_pins REV2_JPEG_IP_DESIGN_0/jpeg_out_a41] [get_bd_pins controller_0/data_in_compute_41]
connect_bd_net [get_bd_pins REV2_JPEG_IP_DESIGN_0/jpeg_out_a42] [get_bd_pins controller_0/data_in_compute_42]
connect_bd_net [get_bd_pins REV2_JPEG_IP_DESIGN_0/jpeg_out_a43] [get_bd_pins controller_0/data_in_compute_43]
connect_bd_net [get_bd_pins REV2_JPEG_IP_DESIGN_0/jpeg_out_a44] [get_bd_pins controller_0/data_in_compute_44]
connect_bd_net [get_bd_pins REV2_JPEG_IP_DESIGN_0/jpeg_out_a45] [get_bd_pins controller_0/data_in_compute_45]
connect_bd_net [get_bd_pins REV2_JPEG_IP_DESIGN_0/jpeg_out_a46] [get_bd_pins controller_0/data_in_compute_46]
connect_bd_net [get_bd_pins REV2_JPEG_IP_DESIGN_0/jpeg_out_a47] [get_bd_pins controller_0/data_in_compute_47]
connect_bd_net [get_bd_pins REV2_JPEG_IP_DESIGN_0/jpeg_out_a48] [get_bd_pins controller_0/data_in_compute_48]
connect_bd_net [get_bd_pins REV2_JPEG_IP_DESIGN_0/jpeg_out_a49] [get_bd_pins controller_0/data_in_compute_49]
connect_bd_net [get_bd_pins REV2_JPEG_IP_DESIGN_0/jpeg_out_a50] [get_bd_pins controller_0/data_in_compute_50]
connect_bd_net [get_bd_pins REV2_JPEG_IP_DESIGN_0/jpeg_out_a51] [get_bd_pins controller_0/data_in_compute_51]
connect_bd_net [get_bd_pins REV2_JPEG_IP_DESIGN_0/jpeg_out_a52] [get_bd_pins controller_0/data_in_compute_52]
connect_bd_net [get_bd_pins REV2_JPEG_IP_DESIGN_0/jpeg_out_a53] [get_bd_pins controller_0/data_in_compute_53]
connect_bd_net [get_bd_pins REV2_JPEG_IP_DESIGN_0/jpeg_out_a54] [get_bd_pins controller_0/data_in_compute_54]
connect_bd_net [get_bd_pins REV2_JPEG_IP_DESIGN_0/jpeg_out_a55] [get_bd_pins controller_0/data_in_compute_55]
connect_bd_net [get_bd_pins REV2_JPEG_IP_DESIGN_0/jpeg_out_a56] [get_bd_pins controller_0/data_in_compute_56]
connect_bd_net [get_bd_pins REV2_JPEG_IP_DESIGN_0/jpeg_out_a57] [get_bd_pins controller_0/data_in_compute_57]
connect_bd_net [get_bd_pins REV2_JPEG_IP_DESIGN_0/jpeg_out_a58] [get_bd_pins controller_0/data_in_compute_58]
connect_bd_net [get_bd_pins REV2_JPEG_IP_DESIGN_0/jpeg_out_a59] [get_bd_pins controller_0/data_in_compute_59]
connect_bd_net [get_bd_pins REV2_JPEG_IP_DESIGN_0/jpeg_out_a60] [get_bd_pins controller_0/data_in_compute_60]
connect_bd_net [get_bd_pins REV2_JPEG_IP_DESIGN_0/jpeg_out_a61] [get_bd_pins controller_0/data_in_compute_61]
connect_bd_net [get_bd_pins REV2_JPEG_IP_DESIGN_0/jpeg_out_a62] [get_bd_pins controller_0/data_in_compute_62]
connect_bd_net [get_bd_pins REV2_JPEG_IP_DESIGN_0/jpeg_out_a63] [get_bd_pins controller_0/data_in_compute_63]
connect_bd_net [get_bd_pins REV2_JPEG_IP_DESIGN_0/jpeg_out_a64] [get_bd_pins controller_0/data_in_compute_64]
connect_bd_net [get_bd_pins REV2_JPEG_IP_DESIGN_0/jpeg_out_a65] [get_bd_pins controller_0/data_in_compute_65]
connect_bd_net [get_bd_pins REV2_JPEG_IP_DESIGN_0/jpeg_out_a66] [get_bd_pins controller_0/data_in_compute_66]
connect_bd_net [get_bd_pins REV2_JPEG_IP_DESIGN_0/jpeg_out_a67] [get_bd_pins controller_0/data_in_compute_67]
connect_bd_net [get_bd_pins REV2_JPEG_IP_DESIGN_0/jpeg_out_a68] [get_bd_pins controller_0/data_in_compute_68]
connect_bd_net [get_bd_pins REV2_JPEG_IP_DESIGN_0/jpeg_out_a69] [get_bd_pins controller_0/data_in_compute_69]
connect_bd_net [get_bd_pins REV2_JPEG_IP_DESIGN_0/jpeg_out_a70] [get_bd_pins controller_0/data_in_compute_70]
connect_bd_net [get_bd_pins REV2_JPEG_IP_DESIGN_0/jpeg_out_a71] [get_bd_pins controller_0/data_in_compute_71]
connect_bd_net [get_bd_pins REV2_JPEG_IP_DESIGN_0/jpeg_out_a72] [get_bd_pins controller_0/data_in_compute_72]
connect_bd_net [get_bd_pins REV2_JPEG_IP_DESIGN_0/jpeg_out_a73] [get_bd_pins controller_0/data_in_compute_73]
connect_bd_net [get_bd_pins REV2_JPEG_IP_DESIGN_0/jpeg_out_a74] [get_bd_pins controller_0/data_in_compute_74]
connect_bd_net [get_bd_pins REV2_JPEG_IP_DESIGN_0/jpeg_out_a75] [get_bd_pins controller_0/data_in_compute_75]
connect_bd_net [get_bd_pins REV2_JPEG_IP_DESIGN_0/jpeg_out_a76] [get_bd_pins controller_0/data_in_compute_76]
connect_bd_net [get_bd_pins REV2_JPEG_IP_DESIGN_0/jpeg_out_a77] [get_bd_pins controller_0/data_in_compute_77]
connect_bd_net [get_bd_pins REV2_JPEG_IP_DESIGN_0/jpeg_out_a78] [get_bd_pins controller_0/data_in_compute_78]
connect_bd_net [get_bd_pins REV2_JPEG_IP_DESIGN_0/jpeg_out_a79] [get_bd_pins controller_0/data_in_compute_79]
connect_bd_net [get_bd_pins REV2_JPEG_IP_DESIGN_0/jpeg_out_a80] [get_bd_pins controller_0/data_in_compute_80]
connect_bd_net [get_bd_pins REV2_JPEG_IP_DESIGN_0/jpeg_out_a81] [get_bd_pins controller_0/data_in_compute_81]
connect_bd_net [get_bd_pins REV2_JPEG_IP_DESIGN_0/jpeg_out_a82] [get_bd_pins controller_0/data_in_compute_82]
connect_bd_net [get_bd_pins REV2_JPEG_IP_DESIGN_0/jpeg_out_a83] [get_bd_pins controller_0/data_in_compute_83]
connect_bd_net [get_bd_pins REV2_JPEG_IP_DESIGN_0/jpeg_out_a84] [get_bd_pins controller_0/data_in_compute_84]
connect_bd_net [get_bd_pins REV2_JPEG_IP_DESIGN_0/jpeg_out_a85] [get_bd_pins controller_0/data_in_compute_85]
connect_bd_net [get_bd_pins REV2_JPEG_IP_DESIGN_0/jpeg_out_a86] [get_bd_pins controller_0/data_in_compute_86]
connect_bd_net [get_bd_pins REV2_JPEG_IP_DESIGN_0/jpeg_out_a87] [get_bd_pins controller_0/data_in_compute_87]
connect_bd_net [get_bd_pins REV2_JPEG_IP_DESIGN_0/jpeg_out_a88] [get_bd_pins controller_0/data_in_compute_88]
connect_bd_net [get_bd_pins REV2_JPEG_IP_DESIGN_0/jpeg_out_a89] [get_bd_pins controller_0/data_in_compute_89]
connect_bd_net [get_bd_pins REV2_JPEG_IP_DESIGN_0/jpeg_out_a90] [get_bd_pins controller_0/data_in_compute_90]
connect_bd_net [get_bd_pins REV2_JPEG_IP_DESIGN_0/jpeg_out_a91] [get_bd_pins controller_0/data_in_compute_91]
connect_bd_net [get_bd_pins REV2_JPEG_IP_DESIGN_0/jpeg_out_a92] [get_bd_pins controller_0/data_in_compute_92]
connect_bd_net [get_bd_pins REV2_JPEG_IP_DESIGN_0/jpeg_out_a93] [get_bd_pins controller_0/data_in_compute_93]
connect_bd_net [get_bd_pins REV2_JPEG_IP_DESIGN_0/jpeg_out_a94] [get_bd_pins controller_0/data_in_compute_94]
connect_bd_net [get_bd_pins REV2_JPEG_IP_DESIGN_0/jpeg_out_a95] [get_bd_pins controller_0/data_in_compute_95]
connect_bd_net [get_bd_pins REV2_JPEG_IP_DESIGN_0/jpeg_out_a96] [get_bd_pins controller_0/data_in_compute_96]
connect_bd_net [get_bd_pins REV2_JPEG_IP_DESIGN_0/jpeg_out_a97] [get_bd_pins controller_0/data_in_compute_97]
connect_bd_net [get_bd_pins REV2_JPEG_IP_DESIGN_0/jpeg_out_a98] [get_bd_pins controller_0/data_in_compute_98]
connect_bd_net [get_bd_pins REV2_JPEG_IP_DESIGN_0/jpeg_out_a99] [get_bd_pins controller_0/data_in_compute_99]
connect_bd_net [get_bd_pins REV2_JPEG_IP_DESIGN_0/jpeg_out_a100] [get_bd_pins controller_0/data_in_compute_100]
connect_bd_net [get_bd_pins REV2_JPEG_IP_DESIGN_0/jpeg_out_a101] [get_bd_pins controller_0/data_in_compute_101]
connect_bd_net [get_bd_pins REV2_JPEG_IP_DESIGN_0/jpeg_out_a102] [get_bd_pins controller_0/data_in_compute_102]
connect_bd_net [get_bd_pins REV2_JPEG_IP_DESIGN_0/jpeg_out_a103] [get_bd_pins controller_0/data_in_compute_103]
connect_bd_net [get_bd_pins REV2_JPEG_IP_DESIGN_0/jpeg_out_a104] [get_bd_pins controller_0/data_in_compute_104]
connect_bd_net [get_bd_pins REV2_JPEG_IP_DESIGN_0/jpeg_out_a105] [get_bd_pins controller_0/data_in_compute_105]
connect_bd_net [get_bd_pins REV2_JPEG_IP_DESIGN_0/jpeg_out_a106] [get_bd_pins controller_0/data_in_compute_106]
connect_bd_net [get_bd_pins REV2_JPEG_IP_DESIGN_0/jpeg_out_a107] [get_bd_pins controller_0/data_in_compute_107]
connect_bd_net [get_bd_pins REV2_JPEG_IP_DESIGN_0/jpeg_out_a108] [get_bd_pins controller_0/data_in_compute_108]
connect_bd_net [get_bd_pins REV2_JPEG_IP_DESIGN_0/jpeg_out_a109] [get_bd_pins controller_0/data_in_compute_109]
connect_bd_net [get_bd_pins REV2_JPEG_IP_DESIGN_0/jpeg_out_a110] [get_bd_pins controller_0/data_in_compute_110]
connect_bd_net [get_bd_pins REV2_JPEG_IP_DESIGN_0/jpeg_out_a111] [get_bd_pins controller_0/data_in_compute_111]
connect_bd_net [get_bd_pins REV2_JPEG_IP_DESIGN_0/jpeg_out_a112] [get_bd_pins controller_0/data_in_compute_112]
connect_bd_net [get_bd_pins REV2_JPEG_IP_DESIGN_0/jpeg_out_a113] [get_bd_pins controller_0/data_in_compute_113]
connect_bd_net [get_bd_pins REV2_JPEG_IP_DESIGN_0/jpeg_out_a114] [get_bd_pins controller_0/data_in_compute_114]
connect_bd_net [get_bd_pins REV2_JPEG_IP_DESIGN_0/jpeg_out_a115] [get_bd_pins controller_0/data_in_compute_115]
connect_bd_net [get_bd_pins REV2_JPEG_IP_DESIGN_0/jpeg_out_a116] [get_bd_pins controller_0/data_in_compute_116]
connect_bd_net [get_bd_pins REV2_JPEG_IP_DESIGN_0/jpeg_out_a117] [get_bd_pins controller_0/data_in_compute_117]
connect_bd_net [get_bd_pins REV2_JPEG_IP_DESIGN_0/jpeg_out_a118] [get_bd_pins controller_0/data_in_compute_118]
connect_bd_net [get_bd_pins REV2_JPEG_IP_DESIGN_0/jpeg_out_a119] [get_bd_pins controller_0/data_in_compute_119]
connect_bd_net [get_bd_pins REV2_JPEG_IP_DESIGN_0/jpeg_out_a120] [get_bd_pins controller_0/data_in_compute_120]
connect_bd_net [get_bd_pins REV2_JPEG_IP_DESIGN_0/jpeg_out_a121] [get_bd_pins controller_0/data_in_compute_121]
connect_bd_net [get_bd_pins REV2_JPEG_IP_DESIGN_0/jpeg_out_a122] [get_bd_pins controller_0/data_in_compute_122]
connect_bd_net [get_bd_pins REV2_JPEG_IP_DESIGN_0/jpeg_out_a123] [get_bd_pins controller_0/data_in_compute_123]
connect_bd_net [get_bd_pins REV2_JPEG_IP_DESIGN_0/jpeg_out_a124] [get_bd_pins controller_0/data_in_compute_124]
connect_bd_net [get_bd_pins REV2_JPEG_IP_DESIGN_0/jpeg_out_a125] [get_bd_pins controller_0/data_in_compute_125]
connect_bd_net [get_bd_pins REV2_JPEG_IP_DESIGN_0/jpeg_out_a126] [get_bd_pins controller_0/data_in_compute_126]
connect_bd_net [get_bd_pins REV2_JPEG_IP_DESIGN_0/jpeg_out_a127] [get_bd_pins controller_0/data_in_compute_127]
connect_bd_net [get_bd_pins ARM_FPGA_Control_Bus_0/jpeg_compute_len_out] [get_bd_pins REV2_JPEG_IP_DESIGN_0/jpeg_len_in]
connect_bd_net [get_bd_pins REV2_JPEG_IP_DESIGN_0/jpeg_len_out] [get_bd_pins ARM_FPGA_Control_Bus_0/jpeg_compute_len_in]
connect_bd_net [get_bd_pins REV2_JPEG_IP_DESIGN_0/jpeg_compute_00_lsb] [get_bd_pins ARM_FPGA_Control_Bus_0/jpeg_compute_00_lsb]
connect_bd_net [get_bd_pins REV2_JPEG_IP_DESIGN_0/jpeg_compute_01_lsb] [get_bd_pins ARM_FPGA_Control_Bus_0/jpeg_compute_01_lsb]
connect_bd_net [get_bd_pins REV2_JPEG_IP_DESIGN_0/jpeg_compute_02_lsb] [get_bd_pins ARM_FPGA_Control_Bus_0/jpeg_compute_02_lsb]
connect_bd_net [get_bd_pins REV2_JPEG_IP_DESIGN_0/jpeg_compute_03_lsb] [get_bd_pins ARM_FPGA_Control_Bus_0/jpeg_compute_03_lsb]
connect_bd_net [get_bd_pins REV2_JPEG_IP_DESIGN_0/jpeg_compute_04_lsb] [get_bd_pins ARM_FPGA_Control_Bus_0/jpeg_compute_04_lsb]
connect_bd_net [get_bd_pins REV2_JPEG_IP_DESIGN_0/jpeg_compute_05_lsb] [get_bd_pins ARM_FPGA_Control_Bus_0/jpeg_compute_05_lsb]
connect_bd_net [get_bd_pins REV2_JPEG_IP_DESIGN_0/jpeg_compute_06_lsb] [get_bd_pins ARM_FPGA_Control_Bus_0/jpeg_compute_06_lsb]
connect_bd_net [get_bd_pins REV2_JPEG_IP_DESIGN_0/jpeg_compute_07_lsb] [get_bd_pins ARM_FPGA_Control_Bus_0/jpeg_compute_07_lsb]
connect_bd_net [get_bd_pins REV2_JPEG_IP_DESIGN_0/jpeg_compute_08_lsb] [get_bd_pins ARM_FPGA_Control_Bus_0/jpeg_compute_08_lsb]
connect_bd_net [get_bd_pins REV2_JPEG_IP_DESIGN_0/jpeg_compute_09_lsb] [get_bd_pins ARM_FPGA_Control_Bus_0/jpeg_compute_09_lsb]
connect_bd_net [get_bd_pins REV2_JPEG_IP_DESIGN_0/jpeg_compute_10_lsb] [get_bd_pins ARM_FPGA_Control_Bus_0/jpeg_compute_10_lsb]
connect_bd_net [get_bd_pins REV2_JPEG_IP_DESIGN_0/jpeg_compute_11_lsb] [get_bd_pins ARM_FPGA_Control_Bus_0/jpeg_compute_11_lsb]
connect_bd_net [get_bd_pins REV2_JPEG_IP_DESIGN_0/jpeg_compute_12_lsb] [get_bd_pins ARM_FPGA_Control_Bus_0/jpeg_compute_12_lsb]
connect_bd_net [get_bd_pins REV2_JPEG_IP_DESIGN_0/jpeg_compute_13_lsb] [get_bd_pins ARM_FPGA_Control_Bus_0/jpeg_compute_13_lsb]
connect_bd_net [get_bd_pins REV2_JPEG_IP_DESIGN_0/jpeg_compute_14_lsb] [get_bd_pins ARM_FPGA_Control_Bus_0/jpeg_compute_14_lsb]
connect_bd_net [get_bd_pins REV2_JPEG_IP_DESIGN_0/jpeg_compute_15_lsb] [get_bd_pins ARM_FPGA_Control_Bus_0/jpeg_compute_15_lsb]
connect_bd_net [get_bd_pins REV2_JPEG_IP_DESIGN_0/jpeg_compute_00_msb] [get_bd_pins ARM_FPGA_Control_Bus_0/jpeg_compute_00_msb]
connect_bd_net [get_bd_pins REV2_JPEG_IP_DESIGN_0/jpeg_compute_01_msb] [get_bd_pins ARM_FPGA_Control_Bus_0/jpeg_compute_01_msb]
connect_bd_net [get_bd_pins REV2_JPEG_IP_DESIGN_0/jpeg_compute_02_msb] [get_bd_pins ARM_FPGA_Control_Bus_0/jpeg_compute_02_msb]
connect_bd_net [get_bd_pins REV2_JPEG_IP_DESIGN_0/jpeg_compute_03_msb] [get_bd_pins ARM_FPGA_Control_Bus_0/jpeg_compute_03_msb]
connect_bd_net [get_bd_pins REV2_JPEG_IP_DESIGN_0/jpeg_compute_04_msb] [get_bd_pins ARM_FPGA_Control_Bus_0/jpeg_compute_04_msb]
connect_bd_net [get_bd_pins REV2_JPEG_IP_DESIGN_0/jpeg_compute_05_msb] [get_bd_pins ARM_FPGA_Control_Bus_0/jpeg_compute_05_msb]
connect_bd_net [get_bd_pins REV2_JPEG_IP_DESIGN_0/jpeg_compute_06_msb] [get_bd_pins ARM_FPGA_Control_Bus_0/jpeg_compute_06_msb]
connect_bd_net [get_bd_pins REV2_JPEG_IP_DESIGN_0/jpeg_compute_07_msb] [get_bd_pins ARM_FPGA_Control_Bus_0/jpeg_compute_07_msb]
connect_bd_net [get_bd_pins REV2_JPEG_IP_DESIGN_0/jpeg_compute_08_msb] [get_bd_pins ARM_FPGA_Control_Bus_0/jpeg_compute_08_msb]
connect_bd_net [get_bd_pins REV2_JPEG_IP_DESIGN_0/jpeg_compute_09_msb] [get_bd_pins ARM_FPGA_Control_Bus_0/jpeg_compute_09_msb]
connect_bd_net [get_bd_pins REV2_JPEG_IP_DESIGN_0/jpeg_compute_10_msb] [get_bd_pins ARM_FPGA_Control_Bus_0/jpeg_compute_10_msb]
connect_bd_net [get_bd_pins REV2_JPEG_IP_DESIGN_0/jpeg_compute_11_msb] [get_bd_pins ARM_FPGA_Control_Bus_0/jpeg_compute_11_msb]
connect_bd_net [get_bd_pins REV2_JPEG_IP_DESIGN_0/jpeg_compute_12_msb] [get_bd_pins ARM_FPGA_Control_Bus_0/jpeg_compute_12_msb]
connect_bd_net [get_bd_pins REV2_JPEG_IP_DESIGN_0/jpeg_compute_13_msb] [get_bd_pins ARM_FPGA_Control_Bus_0/jpeg_compute_13_msb]
connect_bd_net [get_bd_pins REV2_JPEG_IP_DESIGN_0/jpeg_compute_14_msb] [get_bd_pins ARM_FPGA_Control_Bus_0/jpeg_compute_14_msb]
connect_bd_net [get_bd_pins REV2_JPEG_IP_DESIGN_0/jpeg_compute_15_msb] [get_bd_pins ARM_FPGA_Control_Bus_0/jpeg_compute_15_msb]
connect_bd_net [get_bd_pins ARM_FPGA_Control_Bus_0/bram_addr_offset] [get_bd_pins controller_0/bram_addr_offset]

# ---- address map ----
assign_bd_address -offset 0x42800000 -range 64K -target_address_space [get_bd_addr_spaces processing_system7_0/Data] [get_bd_addr_segs axi_timer_0/S_AXI/Reg]
assign_bd_address -offset 0x43C00000 -range 64K -target_address_space [get_bd_addr_spaces processing_system7_0/Data] [get_bd_addr_segs DARC_BRAM2_0/S00_AXI/S00_AXI_reg]
assign_bd_address -offset 0x43C10000 -range 64K -target_address_space [get_bd_addr_spaces processing_system7_0/Data] [get_bd_addr_segs ARM_FPGA_Control_Bus_0/S00_AXI/S00_AXI_reg]
assign_bd_address -offset 0x43C20000 -range 64K -target_address_space [get_bd_addr_spaces processing_system7_0/Data] [get_bd_addr_segs REV2_JPEG_IP_DESIGN_0/S00_AXI/S00_AXI_reg]

validate_bd_design
save_bd_design
